# EAGLE schematic OpenROV Controller 2.6 (EAGLE 6.4)

## Sheet 1 of 8
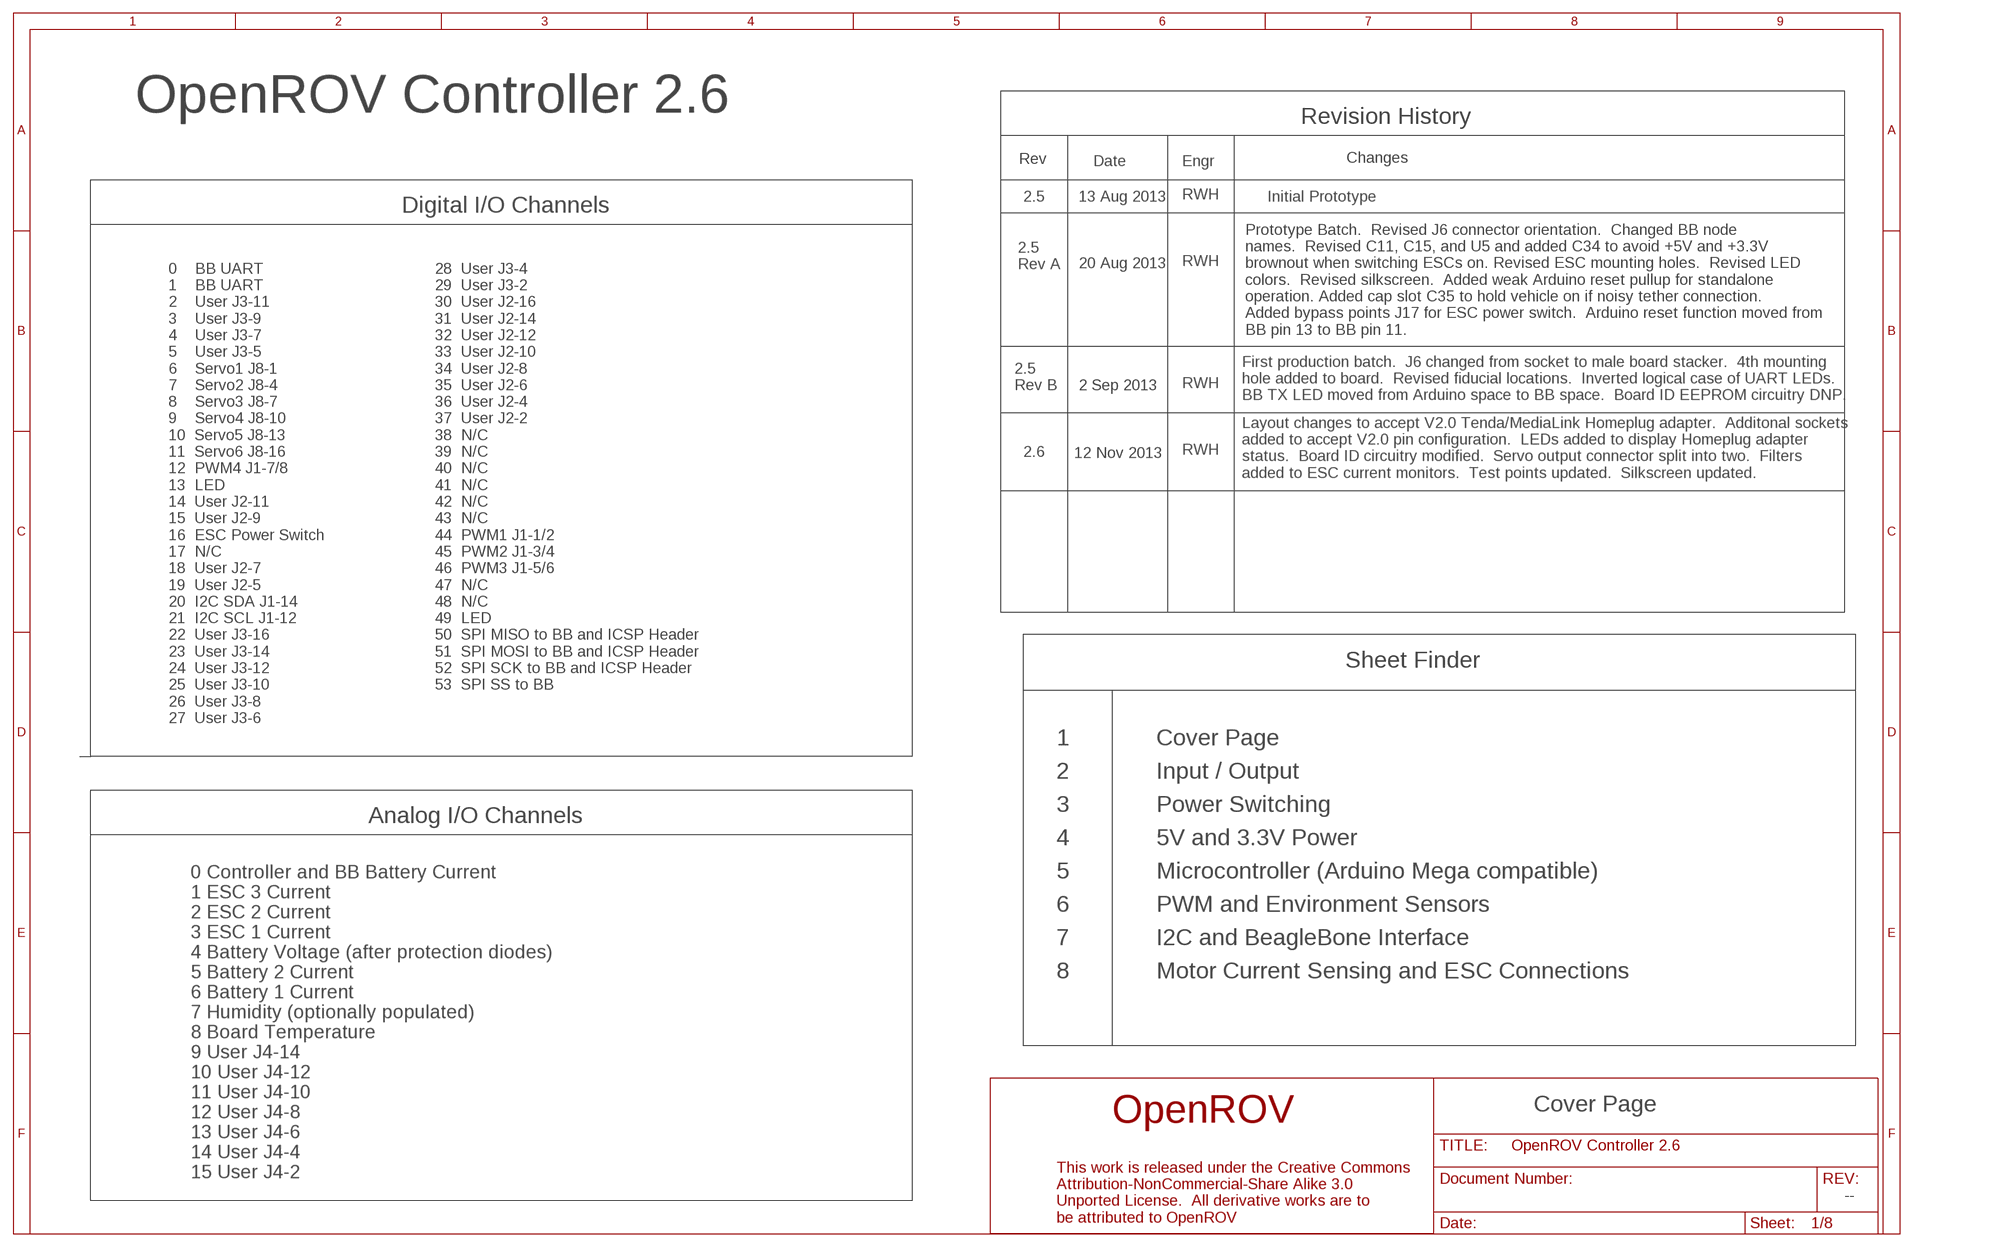
[diagram p0: schematic, sheet 1]

### Notes on the sheet
- OpenROV Controller 2.6
- Revision History
- Rev | Date | Engr | Changes
- 2.5 | 13 Aug 2013 | RWH | Initial Prototype
- Digital I/O Channels
- Prototype Batch.  Revised J6 connector orientation.  Changed BB node
  names.  Revised C11, C15, and U5 and added C34 to avoid +5V and +3.3V
  brownout when switching ESCs on. Revised ESC mounting holes.  Revised LED
  colors.  Revised silkscreen.  Added weak Arduino reset pullup for standalone
  operation. Added cap slot C35 to hold vehicle on if noisy tether connection.
  Added bypass points J17 for ESC power switch.  Arduino reset function moved from
  BB pin 13 to BB pin 11.
- 20 Aug 2013 | RWH
- 2.5
  Rev A
- RWH
- 2.5
  Rev B
- 2 Sep 2013
- First production batch.  J6 changed from socket to male board stacker.  4th mounting
  hole added to board.  Revised fiducial locations.  Inverted logical case of UART LEDs.
  BB TX LED moved from Arduino space to BB space.  Board ID EEPROM circuitry DNP.
- 2.6 | 12 Nov 2013 | RWH
- Layout changes to accept V2.0 Tenda/MediaLink Homeplug adapter.  Additonal sockets
  added to accept V2.0 pin configuration.  LEDs added to display Homeplug adapter
  status.  Board ID circuitry modified.  Servo output connector split into two.  Filters
  added to ESC current monitors.  Test points updated.  Silkscreen updated.
- Sheet Finder
- 0    BB UART
  1    BB UART
  2    User J3-11
  3    User J3-9
  4    User J3-7
  5    User J3-5
  6    Servo1 J8-1
  7    Servo2 J8-4
  8    Servo3 J8-7
  9    Servo4 J8-10
  10  Servo5 J8-13
  11  Servo6 J8-16
  12  PWM4 J1-7/8
  13  LED
  14  User J2-11
  15  User J2-9
  16  ESC Power Switch
  17  N/C
  18  User J2-7
  19  User J2-5
  20  I2C SDA J1-14
  21  I2C SCL J1-12
  22  User J3-16
  23  User J3-14
  24  User J3-12
  25  User J3-10
  26  User J3-8
  27  User J3-6
- 28  User J3-4
  29  User J3-2
  30  User J2-16
  31  User J2-14
  32  User J2-12
  33  User J2-10
  34  User J2-8
  35  User J2-6
  36  User J2-4
  37  User J2-2
  38  N/C
  39  N/C
  40  N/C
  41  N/C
  42  N/C
  43  N/C
  44  PWM1 J1-1/2
  45  PWM2 J1-3/4
  46  PWM3 J1-5/6
  47  N/C
  48  N/C
  49  LED
  50  SPI MISO to BB and ICSP Header
  51  SPI MOSI to BB and ICSP Header
  52  SPI SCK to BB and ICSP Header
  53  SPI SS to BB
- 1 | Cover Page
- 2 | Input / Output
- 3 | Power Switching
- Analog I/O Channels
- 4 | 5V and 3.3V Power
- 5 | Microcontroller (Arduino Mega compatible)
- 6 | PWM and Environment Sensors
- 7 | I2C and BeagleBone Interface
- 8 | Motor Current Sensing and ESC Connections
- Cover Page
- 0	Controller and BB Battery Current
  1	ESC 3 Current
  2	ESC 2 Current
  3	ESC 1 Current
  4	Battery Voltage (after protection diodes)
  5	Battery 2 Current
  6	Battery 1 Current
  7	Humidity (optionally populated)
  8	Board Temperature
  9	User	J4-14
  10	User	J4-12
  11	User	J4-10
  12	User	J4-8
  13	User	J4-6
  14	User	J4-4
  15	User	J4-2
- --

## Sheet 2 of 8
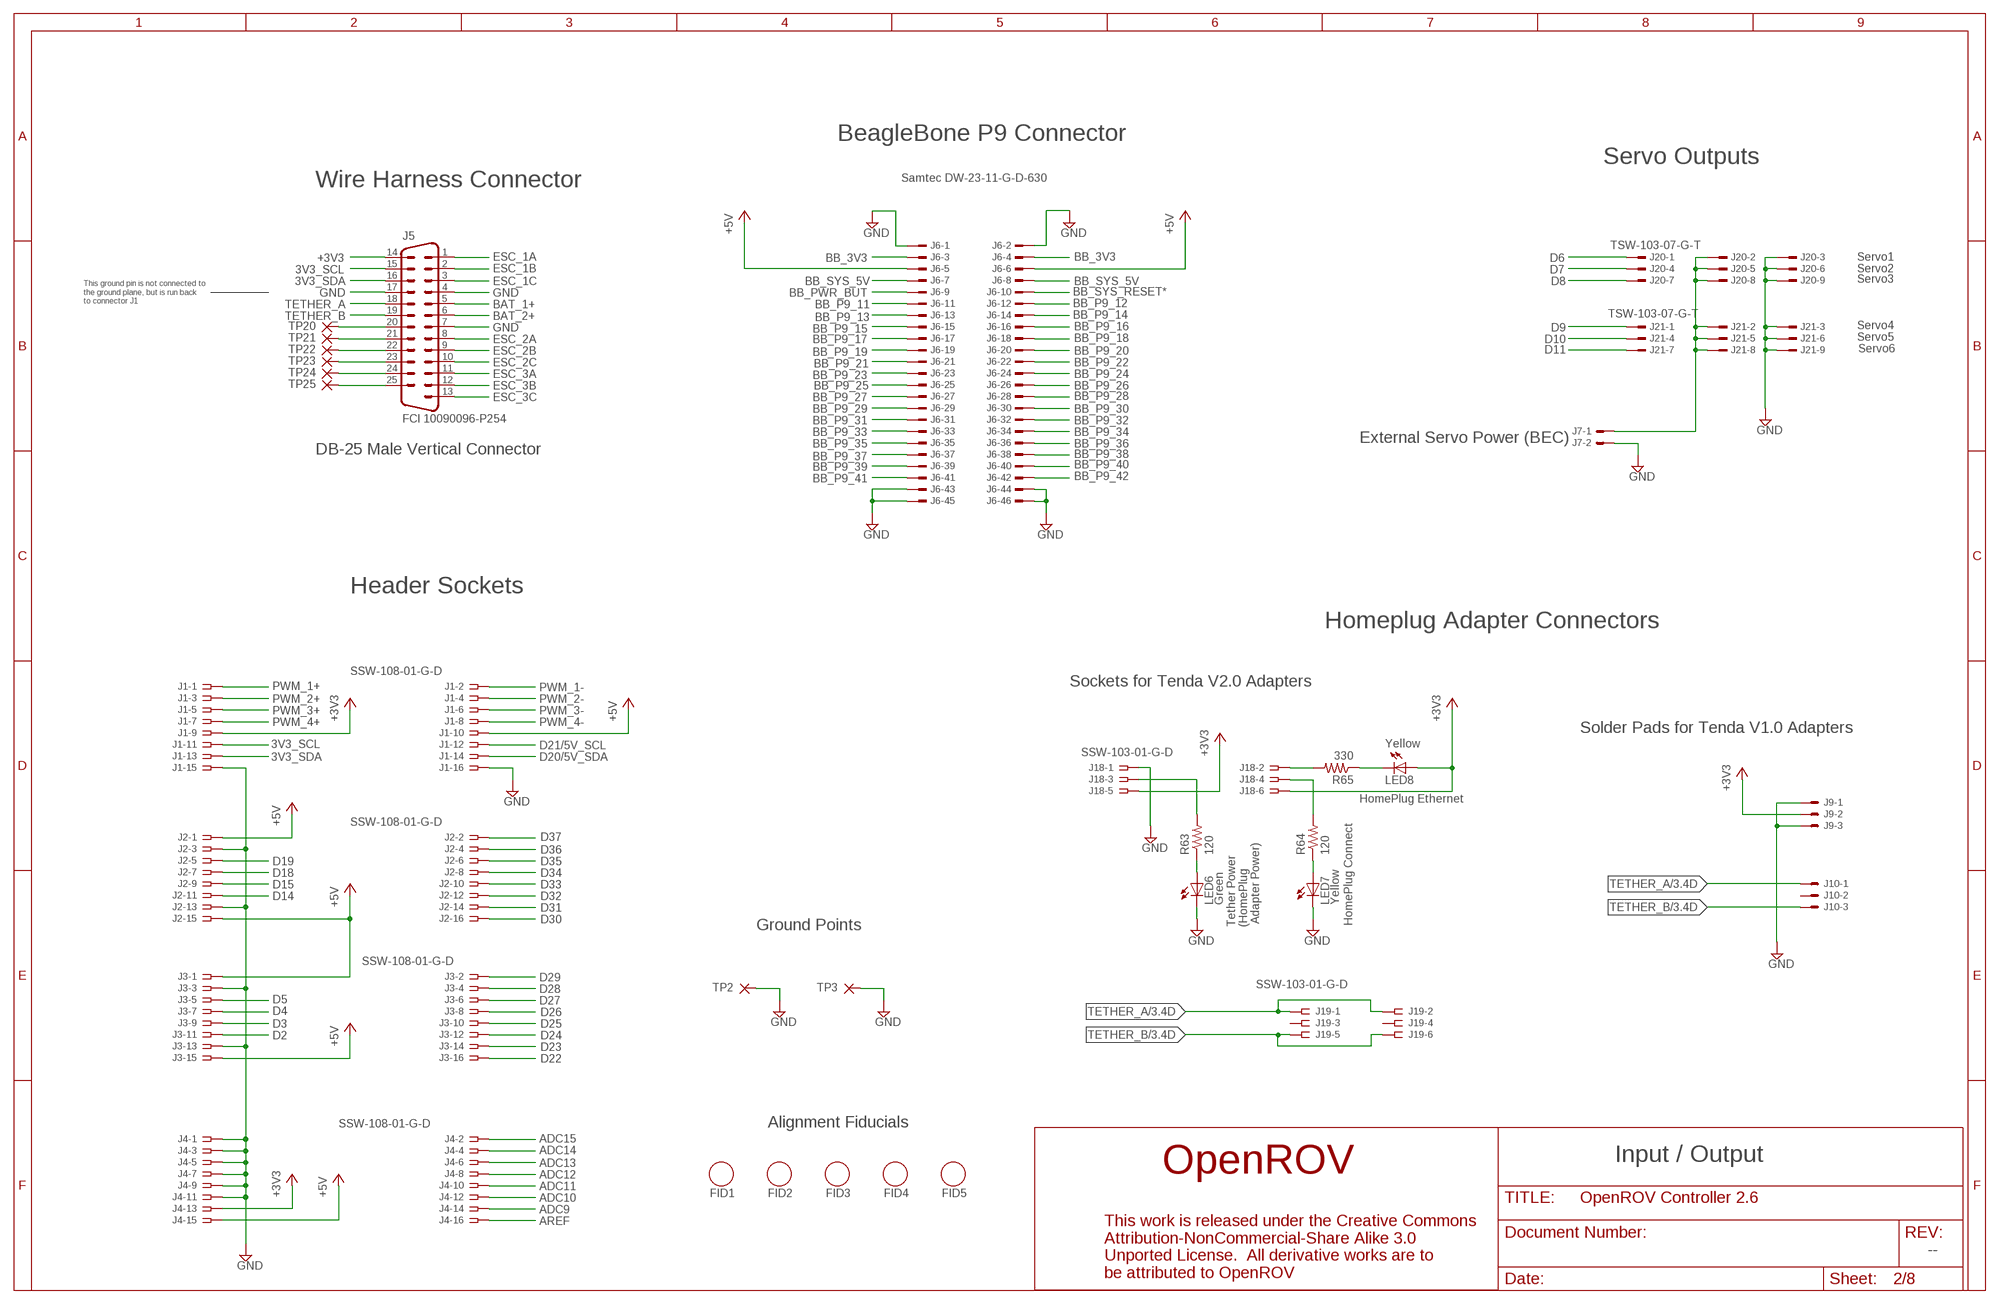
[diagram p1: schematic, sheet 2]

### Parts
FID1  FIDUCIAL_1  [FIDUCIAL_1]
FID2  FIDUCIAL_1  [FIDUCIAL_1]
FID3  FIDUCIAL_1  [FIDUCIAL_1]
FID4  FIDUCIAL_1  [FIDUCIAL_1]
FID5  FIDUCIAL_1  [FIDUCIAL_1]
J1  SSW-108-01-G-D  HDR_SOCKET_2X8  [SSW-108-02-S-D]
J2  SSW-108-01-G-D  HDR_SOCKET_2X8  [SSW-108-02-S-D]
J3  SSW-108-01-G-D  HDR_SOCKET_2X8  [SSW-108-02-S-D]
J4  SSW-108-01-G-D  HDR_SOCKET_2X8  [SSW-108-02-S-D]
J5  FCI 10090096-P254  M25VP  [M25VP]
J6  Samtec DW-23-11-G-D-630  BEAGLEBONE_PIN_HEADER  [TSW-123-02-S-D]
J7  HDR_1X2X0.100-ALT_SILK  [22-23-2021_ALT_SILK]
J9  HDR_1X3X0.100-ALT_SILK  [22-23-2031_ALT_SILK]
J10  HDR_1X3X0.100-ALT_SILK  [22-23-2031_ALT_SILK]
J18  SSW-103-01-G-D  HDR_SOCKET_2X3  [SSW-103-02-S-D]
J19  SSW-103-01-G-D  HDR_SOCKET_2X3  [SSW-103-02-S-D]
J20  TSW-103-07-G-T  HDR_PINS_3X3"  [HDR_PINS_3X3]
J21  TSW-103-07-G-T  HDR_PINS_3X3"  [HDR_PINS_3X3]
LED6  Green  LED-0603  [LED_CHIPLED_0603]
LED7  Yellow  LED-0603  [LED_CHIPLED_0603]
LED8  Yellow  LED-0603  [LED_CHIPLED_0603]
R63  120  RESISTOR-0603  [R0603]
R64  120  RESISTOR-0603  [R0603]
R65  330  RESISTOR-0603  [R0603]
TP2  TEST_PAD-1.0  [2.0/1.0]
TP3  TEST_PAD-1.0  [2.0/1.0]
TP20  TEST_PAD-1.0  [2.0/1.0]
TP21  TEST_PAD-1.0  [2.0/1.0]
TP22  TEST_PAD-1.0  [2.0/1.0]
TP23  TEST_PAD-1.0  [2.0/1.0]
TP24  TEST_PAD-1.0  [2.0/1.0]
TP25  TEST_PAD-1.0  [2.0/1.0]

### Nets
3V3_SCL: J1.11 J5.15 ; also sheet 7
3V3_SDA: J1.13 J5.16 ; also sheet 7
+3V3: J1.9 J4.13 J5.14 J9.2 J18.5 J18.6 LED8.A ; also sheet 4,6,7
+5V: J1.10 J2.1 J2.15 J3.1 J3.15 J4.15 J6.5 J6.6 ; also sheet 3,4,5,6,7,8
ADC9: J4.14 ; also sheet 5
ADC10: J4.12 ; also sheet 5
ADC11: J4.10 ; also sheet 5
ADC12: J4.8 ; also sheet 5
ADC13: J4.6 ; also sheet 5
ADC14: J4.4 ; also sheet 5
ADC15: J4.2 ; also sheet 5
AREF: J4.16 ; also sheet 5
BAT_1+: J5.5 ; also sheet 3
BAT_2+: J5.6 ; also sheet 3
BB_3V3: J6.3 J6.4 ; also sheet 7
BB_P9_11: J6.11 ; also sheet 7
BB_P9_12: J6.12
BB_P9_13: J6.13
BB_P9_14: J6.14
BB_P9_15: J6.15
BB_P9_16: J6.16
BB_P9_17: J6.17 ; also sheet 7
BB_P9_18: J6.18 ; also sheet 7
BB_P9_19: J6.19 ; also sheet 7
BB_P9_20: J6.20 ; also sheet 7
BB_P9_21: J6.21 ; also sheet 7
BB_P9_22: J6.22 ; also sheet 7
BB_P9_23: J6.23
BB_P9_24: J6.24 ; also sheet 7
BB_P9_25: J6.25
BB_P9_26: J6.26 ; also sheet 7
BB_P9_27: J6.27
BB_P9_28: J6.28
BB_P9_29: J6.29
BB_P9_30: J6.30
BB_P9_31: J6.31
BB_P9_32: J6.32
BB_P9_33: J6.33
BB_P9_34: J6.34
BB_P9_35: J6.35
BB_P9_36: J6.36
BB_P9_37: J6.37
BB_P9_38: J6.38
BB_P9_39: J6.39
BB_P9_40: J6.40
BB_P9_41: J6.41
BB_P9_42: J6.42
BB_PWR_BUT: J6.9
BB_SYS_5V: J6.7 J6.8
BB_SYS_RESET*: J6.10 ; also sheet 7
D2: J3.11 ; also sheet 5
D3: J3.9 ; also sheet 5
D4: J3.7 ; also sheet 5
D5: J3.5 ; also sheet 5
D6: J20.P1 ; also sheet 5
D7: J20.P4 ; also sheet 5
D8: J20.P7 ; also sheet 5
D9: J21.P1 ; also sheet 5
D10: J21.P4 ; also sheet 5
D11: J21.P7 ; also sheet 5
D14: J2.11 ; also sheet 5
D15: J2.9 ; also sheet 5
D18: J2.7 ; also sheet 5
D19: J2.5 ; also sheet 5
D20/5V_SDA: J1.14 ; also sheet 5,7
D21/5V_SCL: J1.12 ; also sheet 5,7
D22: J3.16 ; also sheet 5
D23: J3.14 ; also sheet 5
D24: J3.12 ; also sheet 5
D25: J3.10 ; also sheet 5
D26: J3.8 ; also sheet 5
D27: J3.6 ; also sheet 5
D28: J3.4 ; also sheet 5
D29: J3.2 ; also sheet 5
D30: J2.16 ; also sheet 5
D31: J2.14 ; also sheet 5
D32: J2.12 ; also sheet 5
D33: J2.10 ; also sheet 5
D34: J2.8 ; also sheet 5
D35: J2.6 ; also sheet 5
D36: J2.4 ; also sheet 5
D37: J2.2 ; also sheet 5
ESC_1A: J5.1 ; also sheet 8
ESC_1B: J5.2 ; also sheet 8
ESC_1C: J5.3 ; also sheet 8
ESC_2A: J5.8 ; also sheet 8
ESC_2B: J5.9 ; also sheet 8
ESC_2C: J5.10 ; also sheet 8
ESC_3A: J5.11 ; also sheet 8
ESC_3B: J5.12 ; also sheet 8
ESC_3C: J5.13 ; also sheet 8
GND: J1.15 J1.16 J2.3 J2.13 J3.3 J3.13 J4.1 J4.3 J4.5 J4.7 J4.9 J4.11 J5.4 J5.7 J5.17 J6.1 J6.2 J6.43 J6.44 J6.45 J6.46 J7.2 J9.1 J9.3 J18.1 J20.P3 J20.P6 J20.P9 J21.P3 J21.P6 J21.P9 LED6.C LED7.C TP2.1(P) TP3.1(P) ; also sheet 3,4,5,6,7,8
N$9: LED6.A R63.1
N$21: J5.24 TP24.1(P)
N$22: J5.20 TP20.1(P)
N$26: J7.1 J20.P2 J20.P5 J20.P8 J21.P2 J21.P5 J21.P8
N$29: J5.21 TP21.1(P)
N$30: J5.22 TP22.1(P)
N$31: J5.23 TP23.1(P)
N$32: J5.25 TP25.1(P)
N$46: J18.3 R63.2
N$48: J18.4 R64.2
N$49: LED7.A R64.1
N$50: J18.2 R65.2
N$51: LED8.C R65.1
PWM_1+: J1.1 ; also sheet 6
PWM_1-: J1.2 ; also sheet 6
PWM_2+: J1.3 ; also sheet 6
PWM_2-: J1.4 ; also sheet 6
PWM_3+: J1.5 ; also sheet 6
PWM_3-: J1.6 ; also sheet 6
PWM_4+: J1.7 ; also sheet 6
PWM_4-: J1.8 ; also sheet 6
TETHER_A: J5.18 J10.1 J19.1 J19.2 ; also sheet 3
TETHER_B: J5.19 J10.3 J19.5 J19.6 ; also sheet 3
Unconnected: J5.G1 J5.G2 J10.2 J19.3 J19.4

### Notes on the sheet
- BeagleBone P9 Connector
- Servo Outputs
- Wire Harness Connector
- Servo1
- Servo2
- Servo3
- This ground pin is not connected to
  the ground plane, but is run back
  to connector J1
- Servo4
- Servo5
- Servo6
- External Servo Power (BEC)
- DB-25 Male Vertical Connector
- Header Sockets
- Homeplug Adapter Connectors
- Sockets for Tenda V2.0 Adapters
- Solder Pads for Tenda V1.0 Adapters
- HomePlug Ethernet
- HomePlug Connect
- Tether Power
  (HomePlug
   Adapter Power)
- Ground Points
- Alignment Fiducials
- Input / Output
- --

## Sheet 3 of 8
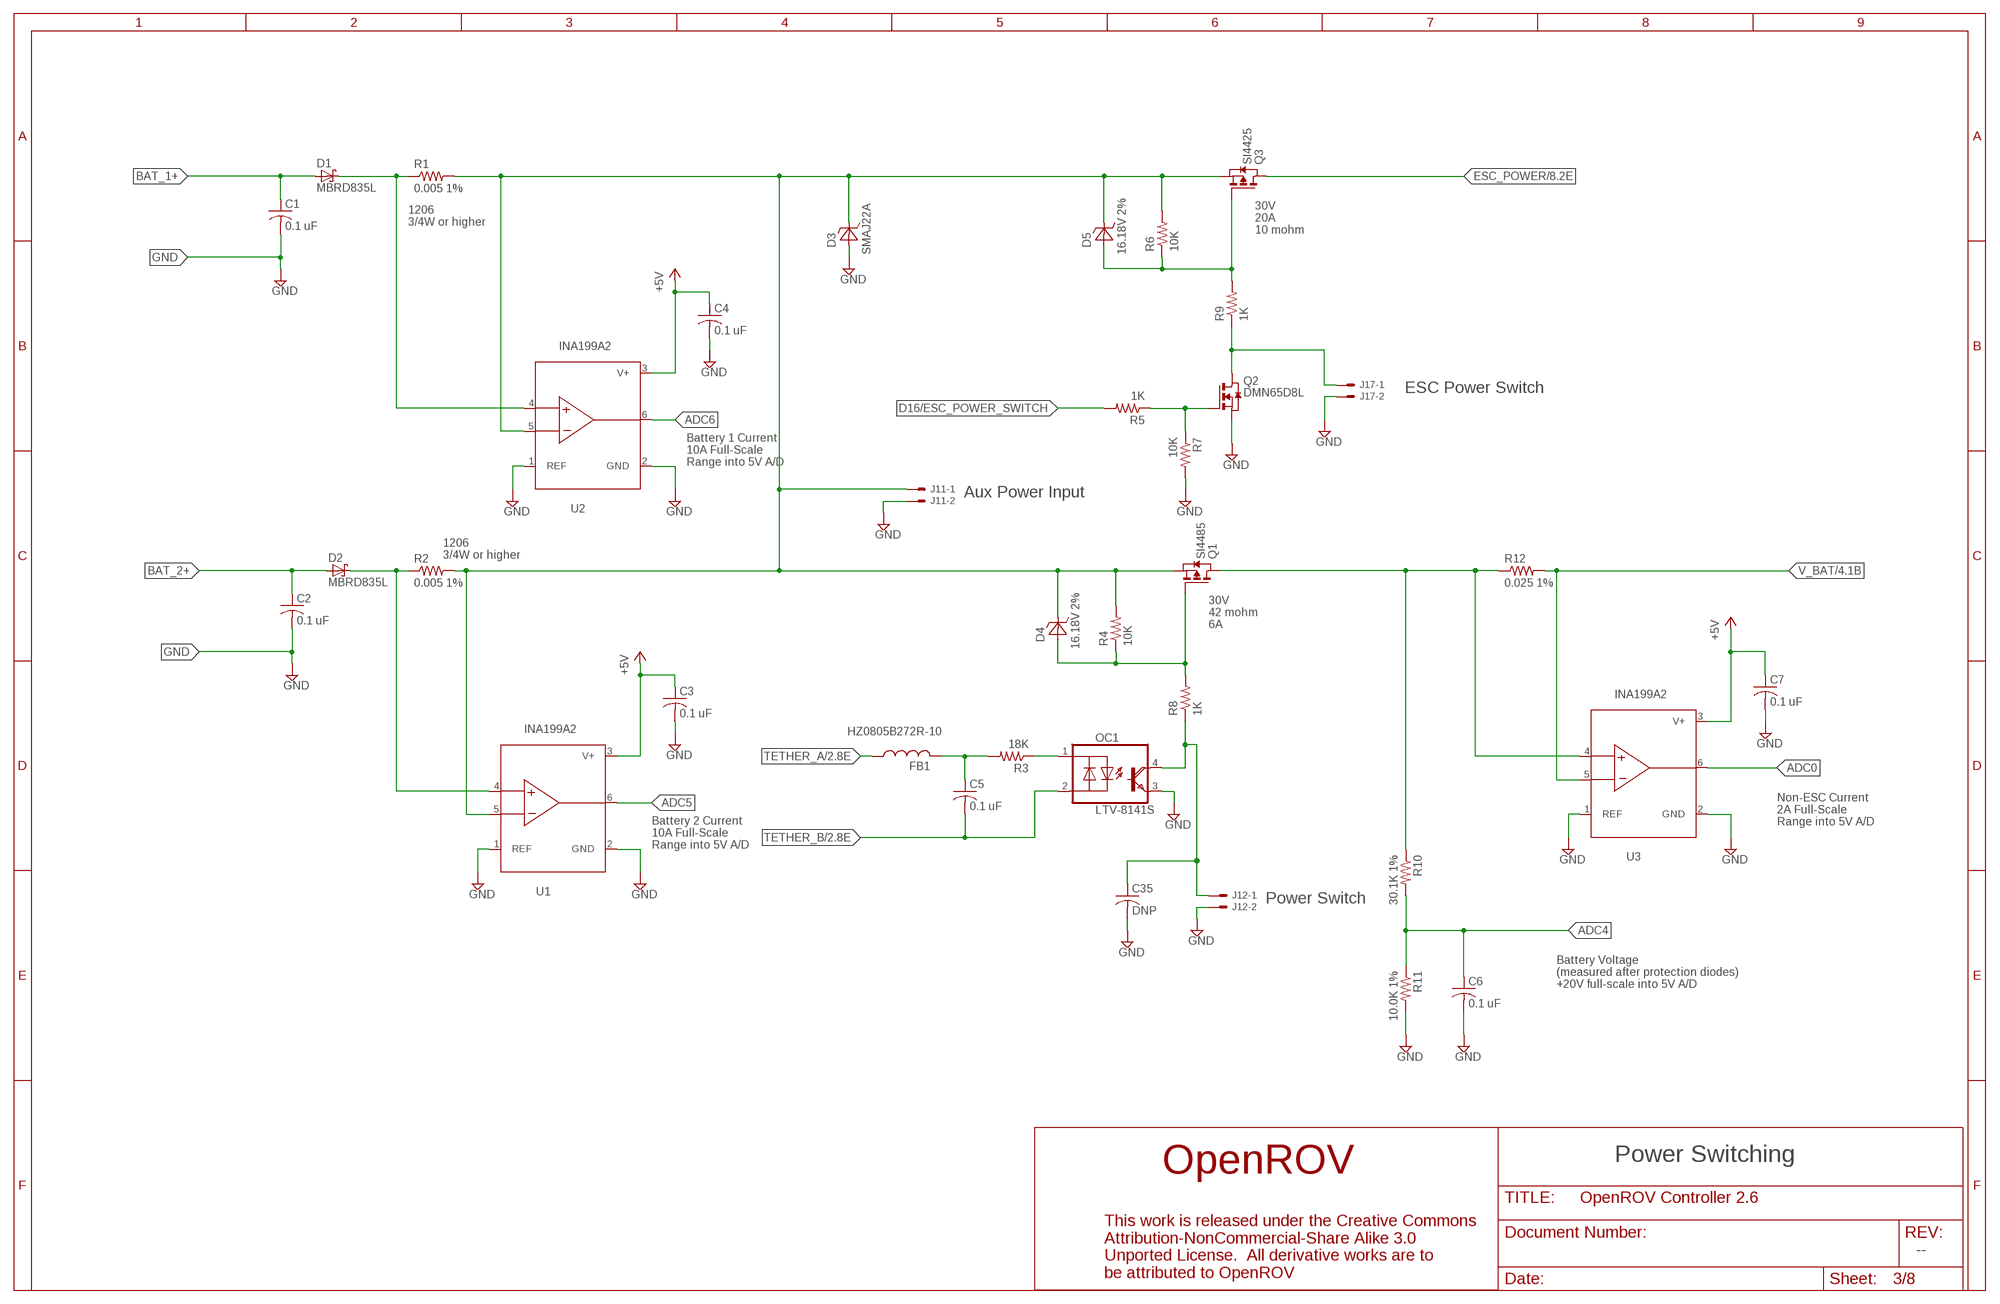
[diagram p2: schematic, sheet 3]

### Parts
C1  0.1 uF  CAP0603  [R0603]
C2  0.1 uF  CAP0603  [R0603]
C3  0.1 uF  CAP0603  [R0603]
C4  0.1 uF  CAP0603  [R0603]
C5  0.1 uF  CAP0603  [R0603]
C6  0.1 uF  CAP0603  [R0603]
C7  0.1 uF  CAP0603  [R0603]
C35  DNP  CAP0805  [R0805]
D1  MBRD835L  SCHOTTKYDPAK  [DPAK]
D2  MBRD835L  SCHOTTKYDPAK  [DPAK]
D3  SMAJ22A  ZENER-TVSDO-214AC  [DO214AC]
D4  16.18V 2%  ZENER-TVSSOD323  [SOD323]
D5  16.18V 2%  ZENER-TVSSOD323  [SOD323]
FB1  HZ0805B272R-10  FERRITESIZE_0805  [R0805]
J11  HDR_1X2X0.100-ALT_SILK  [22-23-2021_ALT_SILK]
J12  HDR_1X2X0.100-ALT_SILK  [22-23-2021_ALT_SILK]
J17  HDR_1X2X0.100-ALT_SILK  [22-23-2021_ALT_SILK]
OC1  LTV-8141S  [DIL4-SMD]
Q1  SI4485  PMOS-FET  [SO8]
Q2  DMN65D8L  NMOS-FETSOT23  [SOT23]
Q3  SI4425  PMOS-FET  [SO8]
R1  0.005 1%  RESISTOR-1206  [R1206]
R2  0.005 1%  RESISTOR-1206  [R1206]
R3  18K  RESISTOR-0603  [R0603]
R4  10K  RESISTOR-0603  [R0603]
R5  1K  RESISTOR-0603  [R0603]
R6  10K  RESISTOR-0603  [R0603]
R7  10K  RESISTOR-0603  [R0603]
R8  1K  RESISTOR-0603  [R0603]
R9  1K  RESISTOR-0603  [R0603]
R10  30.1K 1%  RESISTOR-0603  [R0603]
R11  10.0K 1%  RESISTOR-0603  [R0603]
R12  0.025 1%  RESISTOR-0805  [R0805]
U1  INA199A2  INA199  [SC70-6L]
U2  INA199A2  INA199  [SC70-6L]
U3  INA199A2  INA199  [SC70-6L]

### Nets
+5V: C3.1 C4.1 C7.1 U1.3(V+) U2.3(V+) U3.3(V+) ; also sheet 2,4,5,6,7,8
ADC0: U3.6(VOUT) ; also sheet 5
ADC4: C6.1 R10.2 R11.1 ; also sheet 5
ADC5: U1.6(VOUT) ; also sheet 5
ADC6: U2.6(VOUT) ; also sheet 5
BAT_1+: C1.1 D1.1(A) D1.3(A) ; also sheet 2
BAT_1-1: Q1.5(D) Q1.6(D) Q1.7(D) Q1.8(D) R10.1 R12.1 U3.4(IN+)
BAT_2+: C2.1 D2.1(A) D2.3(A) ; also sheet 2
D16/ESC_POWER_SWITCH: R5.2 ; also sheet 5
ESC_POWER: Q3.5(D) Q3.6(D) Q3.7(D) Q3.8(D) ; also sheet 8
GND: C1.2 C2.2 C3.2 C4.2 C6.2 C7.2 C35.2 D3.A J11.2 J12.2 J17.2 OC1.3(E) Q2.2(S) R7.2 R11.2 U1.1(REF) U1.2(GND) U2.1(REF) U2.2(GND) U3.1(REF) U3.2(GND) ; also sheet 2,4,5,6,7,8
N$1: OC1.1(IN-A) R3.1
N$2: D5.A Q3.4(G) R6.1 R9.2
N$3: J17.1 Q2.3(D) R9.1
N$4: D1.4(C) R1.1 U2.4(IN+)
N$6: Q2.1(G) R5.1 R7.1
N$7: D3.C D4.C D5.C J11.1 Q1.1(S) Q1.2(S) Q1.3(S) Q3.1(S) Q3.2(S) Q3.3(S) R1.2 R2.2 R4.2 R6.2 U1.5(IN-) U2.5(IN-)
N$8: D4.A Q1.4(G) R4.1 R8.2
N$10: C5.1 FB1.2 R3.2
N$41: D2.4(C) R2.1 U1.4(IN+)
N$45: C35.1 J12.1 OC1.4(C) R8.1
TETHER_A: FB1.1 ; also sheet 2
TETHER_B: C5.2 OC1.2(IN-B) ; also sheet 2
V_BAT: R12.2 U3.5(IN-) ; also sheet 4,6

### Notes on the sheet
- 1206
  3/4W or higher
- 30V
  20A
  10 mohm
- ESC Power Switch
- Battery 1 Current
  10A Full-Scale
  Range into 5V A/D
- Aux Power Input
- 1206
  3/4W or higher
- 30V
  42 mohm
  6A
- Non-ESC Current
  2A Full-Scale
  Range into 5V A/D
- Battery 2 Current
  10A Full-Scale
  Range into 5V A/D
- Power Switch
- Battery Voltage
  (measured after protection diodes)
  +20V full-scale into 5V A/D
- Power Switching
- --

## Sheet 4 of 8
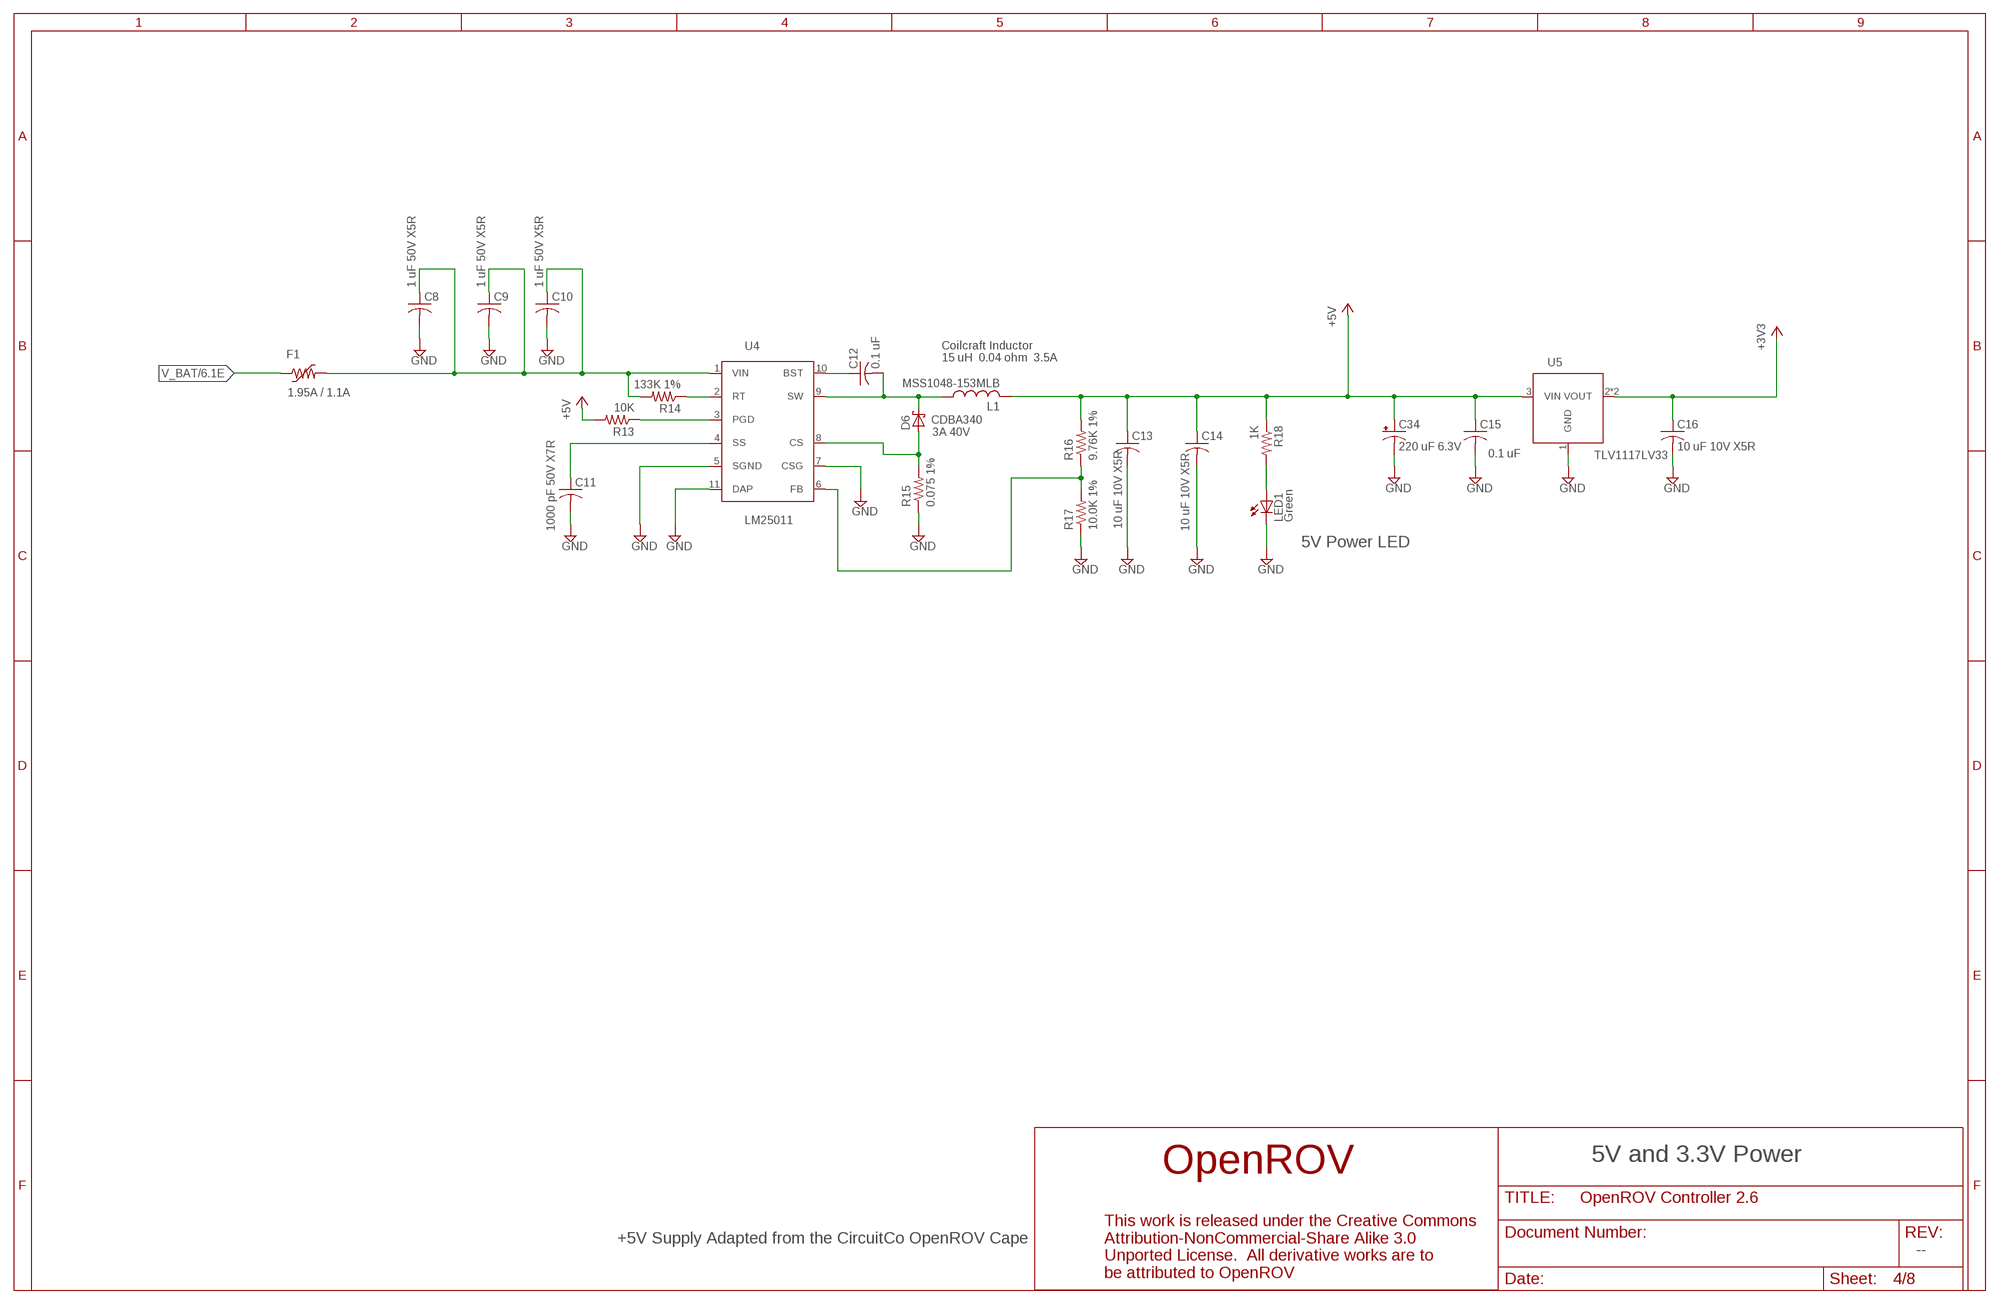
[diagram p3: schematic, sheet 4]

### Parts
C8  1 uF 50V X5R  CAP0805  [R0805]
C9  1 uF 50V X5R  CAP0805  [R0805]
C10  1 uF 50V X5R  CAP0805  [R0805]
C11  1000 pF 50V X7R  CAP0603  [R0603]
C12  0.1 uF  CAP0603  [R0603]
C13  10 uF 10V X5R  CAP0805  [R0805]
C14  10 uF 10V X5R  CAP0805  [R0805]
C15  0.1 uF  CAP0603  [R0603]
C16  10 uF 10V X5R  CAP0805  [R0805]
C34  220 uF 6.3V  CAP-POLARIZED-B_CASE  [KEMET_B-CAPACITOR]
D6  CDBA340  SCHOTTKYDO214AC  [DO214AC]
F1  1.95A / 1.1A  POLYFUSE-1812  [R1812]
L1  MSS1048-153MLB  INDUCTOR-MSS1048  [MSS1048]
LED1  Green  LED-0603  [LED_CHIPLED_0603]
R13  10K  RESISTOR-0603  [R0603]
R14  133K 1%  RESISTOR-0603  [R0603]
R15  0.075 1%  RESISTOR-1210  [R1210]
R16  9.76K 1%  RESISTOR-0603  [R0603]
R17  10.0K 1%  RESISTOR-0603  [R0603]
R18  1K  RESISTOR-0603  [R0603]
U4  LM25011  [VSSOP-10]
U5  TLV1117LV33  AP1117SOT223  [SOT223]

### Nets
+3V3: C16.1 U5.2(VOUT) U5.4(VOUT) ; also sheet 2,6,7
+5V: C13.1 C14.1 C15.1 C34.+ L1.P$2 R13.2 R16.2 R18.1 U5.3(VIN) ; also sheet 2,3,5,6,7,8
FUSED_VBAT: C8.1 C9.1 C10.1 F1.2 R14.2 U4.1(VIN)
GND: C8.2 C9.2 C10.2 C11.2 C13.2 C14.2 C15.2 C16.2 C34.- LED1.C R15.1 R17.1 U4.5(SGND) U4.7(CSG) U4.11(DAP) U5.1(GND) ; also sheet 2,3,5,6,7,8
N$11: LED1.A R18.2
N$16: R16.1 R17.2 U4.6(FB)
N$20: D6.A R15.2 U4.8(CS)
N$23: C11.1 U4.4(SS)
N$24: C12.1 U4.10(BST)
N$25: C12.2 D6.C L1.P$1 U4.9(SW)
N$27: R14.1 U4.2(RT)
N$28: R13.1 U4.3(PGD)
V_BAT: F1.1 ; also sheet 3,6

### Notes on the sheet
- Coilcraft Inductor
  15 uH  0.04 ohm  3.5A
- 3A 40V
- 5V Power LED
- 5V and 3.3V Power
- +5V Supply Adapted from the CircuitCo OpenROV Cape
- --

## Sheet 5 of 8
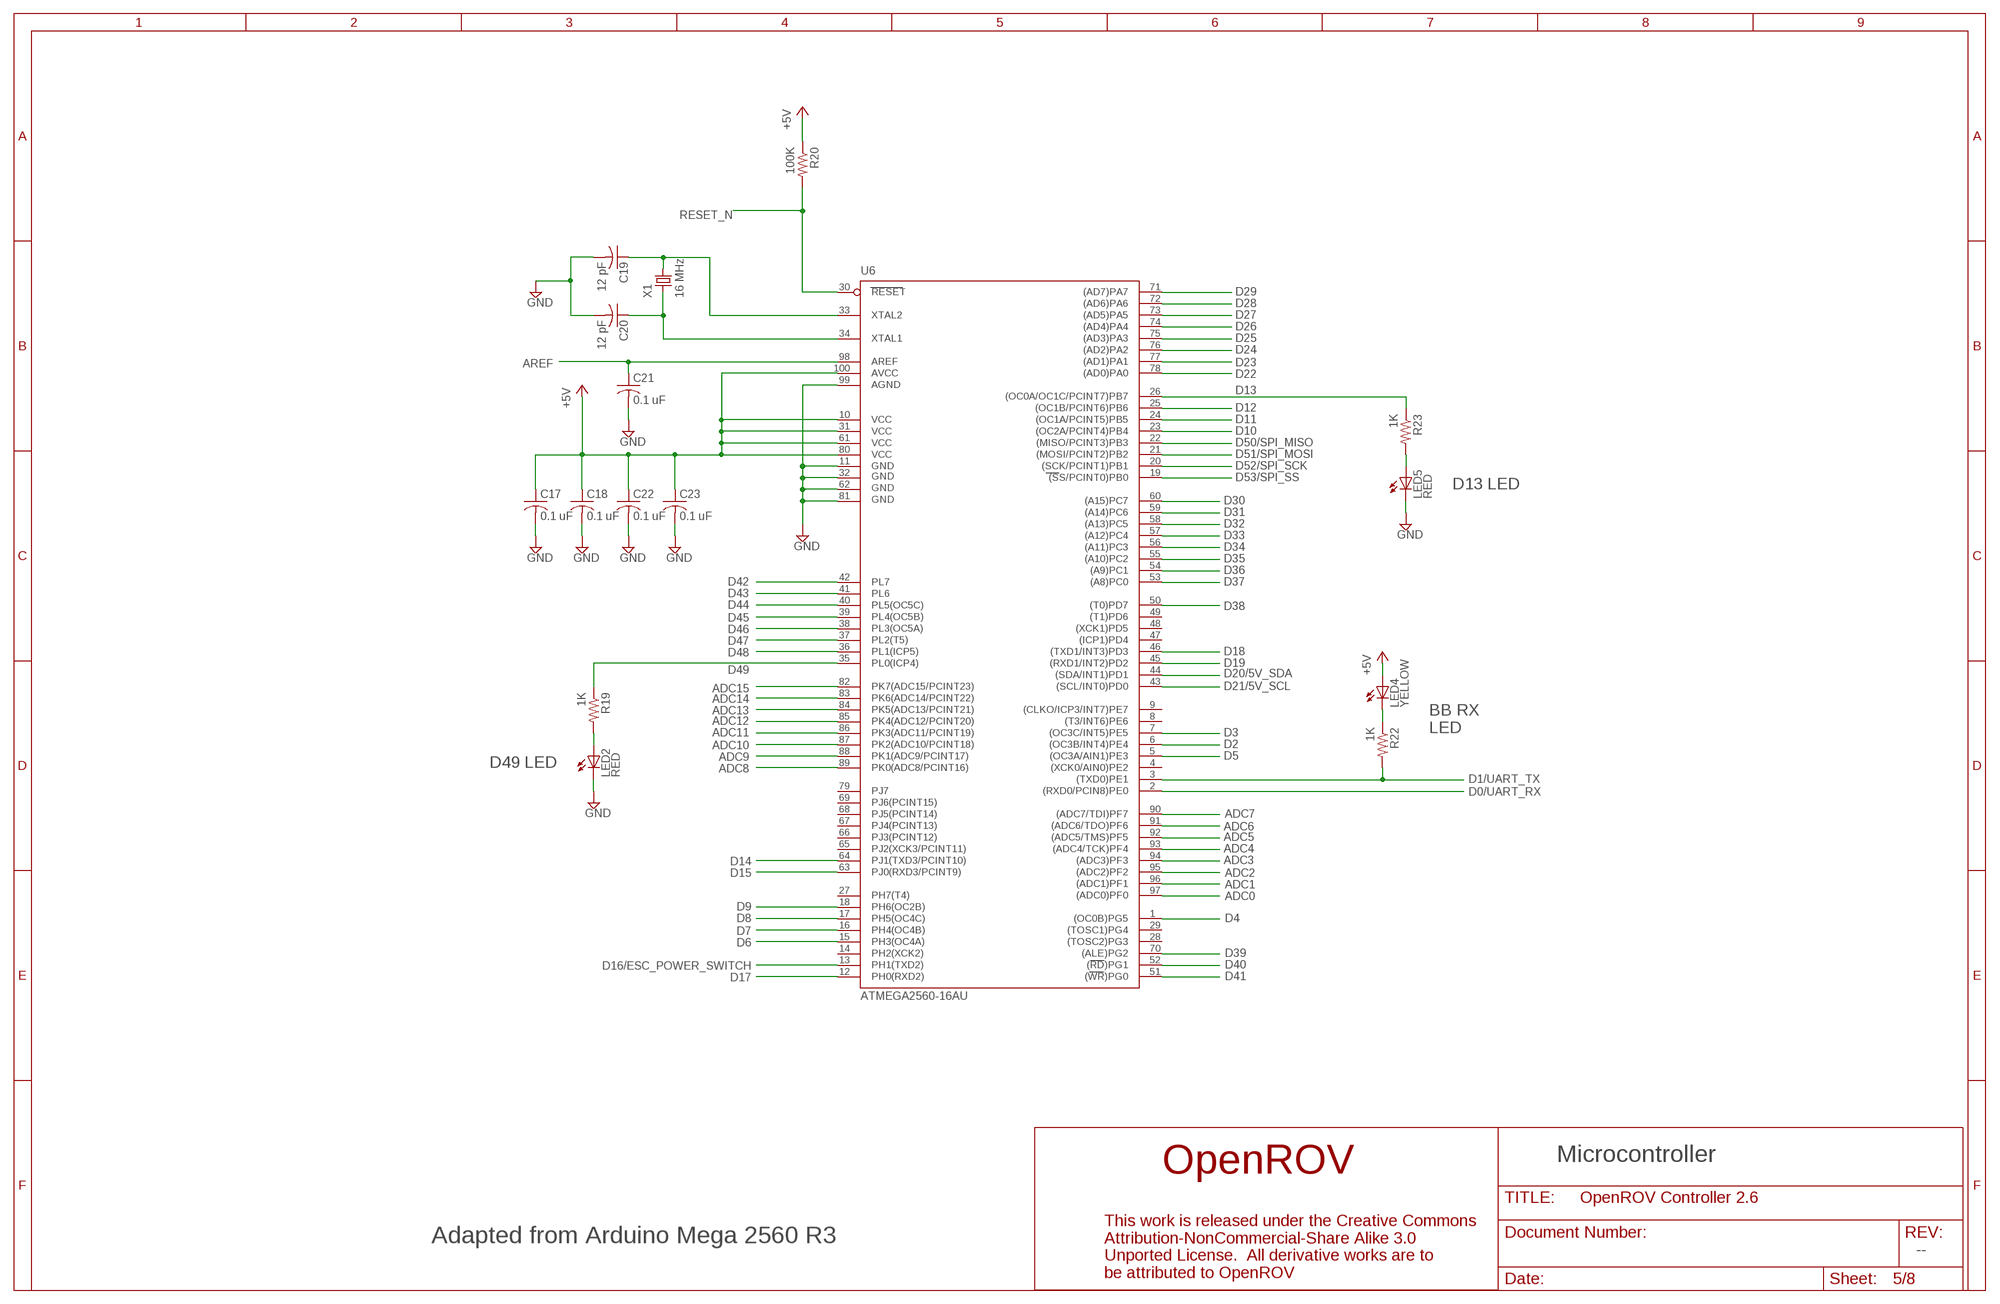
[diagram p4: schematic, sheet 5]

### Parts
C17  0.1 uF  CAP0603  [R0603]
C18  0.1 uF  CAP0603  [R0603]
C19  12 pF  CAP0603  [R0603]
C20  12 pF  CAP0603  [R0603]
C21  0.1 uF  CAP0603  [R0603]
C22  0.1 uF  CAP0603  [R0603]
C23  0.1 uF  CAP0603  [R0603]
LED2  RED  LED-0603  [LED_CHIPLED_0603]
LED4  YELLOW  LED-0603  [LED_CHIPLED_0603]
LED5  RED  LED-0603  [LED_CHIPLED_0603]
R19  1K  RESISTOR-0603  [R0603]
R20  100K  RESISTOR-0603  [R0603]
R22  1K  RESISTOR-0603  [R0603]
R23  1K  RESISTOR-0603  [R0603]
U6  ATMEGA2560-16AU  SMARTPRJ_ATMEGA25602560-16AU  [SMARTPRJ_TQFP100]
X1  16 MHz  CRYSTAL-5*3.2  [DISCRETE_2P-SMD-5X3.2]

### Nets
+5V: C17.1 C18.1 C22.1 C23.1 LED4.A R20.1 U6.10(VCC) U6.31(VCC1) U6.61(VCC2) U6.80(VCC3) U6.100(AVCC) ; also sheet 2,3,4,6,7,8
ADC0: U6.97((ADC0)PF0) ; also sheet 3
ADC1: U6.96((ADC1)PF1) ; also sheet 8
ADC2: U6.95((ADC2)PF2) ; also sheet 8
ADC3: U6.94((ADC3)PF3) ; also sheet 8
ADC4: U6.93((ADC4/TCK)PF4) ; also sheet 3
ADC5: U6.92((ADC5/TMS)PF5) ; also sheet 3
ADC6: U6.91((ADC6/TDO)PF6) ; also sheet 3
ADC7: U6.90((ADC7/TDI)PF7) ; also sheet 6
ADC8: U6.89(PK0(ADC8/PCINT16)) ; also sheet 6
ADC9: U6.88(PK1(ADC9/PCINT17)) ; also sheet 2
ADC10: U6.87(PK2(ADC10/PCINT18)) ; also sheet 2
ADC11: U6.86(PK3(ADC11/PCINT19)) ; also sheet 2
ADC12: U6.85(PK4(ADC12/PCINT20)) ; also sheet 2
ADC13: U6.84(PK5(ADC13/PCINT21)) ; also sheet 2
ADC14: U6.83(PK6(ADC14/PCINT22)) ; also sheet 2
ADC15: U6.82(PK7(ADC15/PCINT23)) ; also sheet 2
AREF: C21.1 U6.98(AREF) ; also sheet 2
D0/UART_RX: U6.2((RXD0/PCIN8)PE0) ; also sheet 7
D1/UART_TX: R22.2 U6.3((TXD0)PE1) ; also sheet 7
D2: U6.6((OC3B/INT4)PE4) ; also sheet 2
D3: U6.7((OC3C/INT5)PE5) ; also sheet 2
D4: U6.1((OC0B)PG5) ; also sheet 2
D5: U6.5((OC3A/AIN1)PE3) ; also sheet 2
D6: U6.15(PH3(OC4A)) ; also sheet 2
D7: U6.16(PH4(OC4B)) ; also sheet 2
D8: U6.17(PH5(OC4C)) ; also sheet 2
D9: U6.18(PH6(OC2B)) ; also sheet 2
D10: U6.23((OC2A/PCINT4)PB4) ; also sheet 2
D11: U6.24((OC1A/PCINT5)PB5) ; also sheet 2
D12: U6.25((OC1B/PCINT6)PB6) ; also sheet 6
D13: R23.1 U6.26((OC0A/OC1C/PCINT7)PB7)
D14: U6.64(PJ1(TXD3/PCINT10)) ; also sheet 2
D15: U6.63(PJ0(RXD3/PCINT9)) ; also sheet 2
D16/ESC_POWER_SWITCH: U6.13(PH1(TXD2)) ; also sheet 3
D17: U6.12(PH0(RXD2))
D18: U6.46((TXD1/INT3)PD3) ; also sheet 2
D19: U6.45((RXD1/INT2)PD2) ; also sheet 2
D20/5V_SDA: U6.44((SDA/INT1)PD1) ; also sheet 2,7
D21/5V_SCL: U6.43((SCL/INT0)PD0) ; also sheet 2,7
D22: U6.78((AD0)PA0) ; also sheet 2
D23: U6.77((AD1)PA1) ; also sheet 2
D24: U6.76((AD2)PA2) ; also sheet 2
D25: U6.75((AD3)PA3) ; also sheet 2
D26: U6.74((AD4)PA4) ; also sheet 2
D27: U6.73((AD5)PA5) ; also sheet 2
D28: U6.72((AD6)PA6) ; also sheet 2
D29: U6.71((AD7)PA7) ; also sheet 2
D30: U6.60((A15)PC7) ; also sheet 2
D31: U6.59((A14)PC6) ; also sheet 2
D32: U6.58((A13)PC5) ; also sheet 2
D33: U6.57((A12)PC4) ; also sheet 2
D34: U6.56((A11)PC3) ; also sheet 2
D35: U6.55((A10)PC2) ; also sheet 2
D36: U6.54((A9)PC1) ; also sheet 2
D37: U6.53((A8)PC0) ; also sheet 2
D38: U6.50((T0)PD7)
D39: U6.70((ALE)PG2)
D40: U6.52((RD)PG1)
D41: U6.51((WR)PG0)
D42: U6.42(PL7)
D43: U6.41(PL6)
D44: U6.40(PL5(OC5C)) ; also sheet 6
D45: U6.39(PL4(OC5B)) ; also sheet 6
D46: U6.38(PL3(OC5A)) ; also sheet 6
D47: U6.37(PL2(T5))
D48: U6.36(PL1(ICP5))
D49: R19.1 U6.35(PL0(ICP4))
D50/SPI_MISO: U6.22((MISO/PCINT3)PB3) ; also sheet 7
D51/SPI_MOSI: U6.21((MOSI/PCINT2)PB2) ; also sheet 7
D52/SPI_SCK: U6.20((SCK/PCINT1)PB1) ; also sheet 7
D53/SPI_SS: U6.19((SS/PCINT0)PB0) ; also sheet 7
GND: C17.2 C18.2 C19.2 C20.2 C21.2 C22.2 C23.2 LED2.C LED5.C U6.11(GND) U6.32(GND1) U6.62(GND2) U6.81(GND3) U6.99(AGND) ; also sheet 2,3,4,6,7,8
N$5: LED2.A R19.2
N$15: C19.1 U6.33(XTAL2) X1.2
N$35: C20.1 U6.34(XTAL1) X1.1
N$36: LED5.A R23.2
N$42: LED4.C R22.1
RESET_N: R20.2 U6.30(RESET) ; also sheet 7
Unconnected: U6.4((XCK0/AIN0)PE2) U6.8((T3/INT6)PE6) U6.9((CLKO/ICP3/INT7)PE7) U6.14(PH2(XCK2)) U6.27(PH7(T4)) U6.28((TOSC2)PG3) U6.29((TOSC1)PG4) U6.47((ICP1)PD4) U6.48((XCK1)PD5) U6.49((T1)PD6) U6.65(PJ2(XCK3/PCINT11)) U6.66(PJ3(PCINT12)) U6.67(PJ4(PCINT13)) U6.68(PJ5(PCINT14)) U6.69(PJ6(PCINT15)) U6.79(PJ7)

### Notes on the sheet
- D13 LED
- BB RX
  LED
- D49 LED
- Microcontroller
- Adapted from Arduino Mega 2560 R3
- --

## Sheet 6 of 8
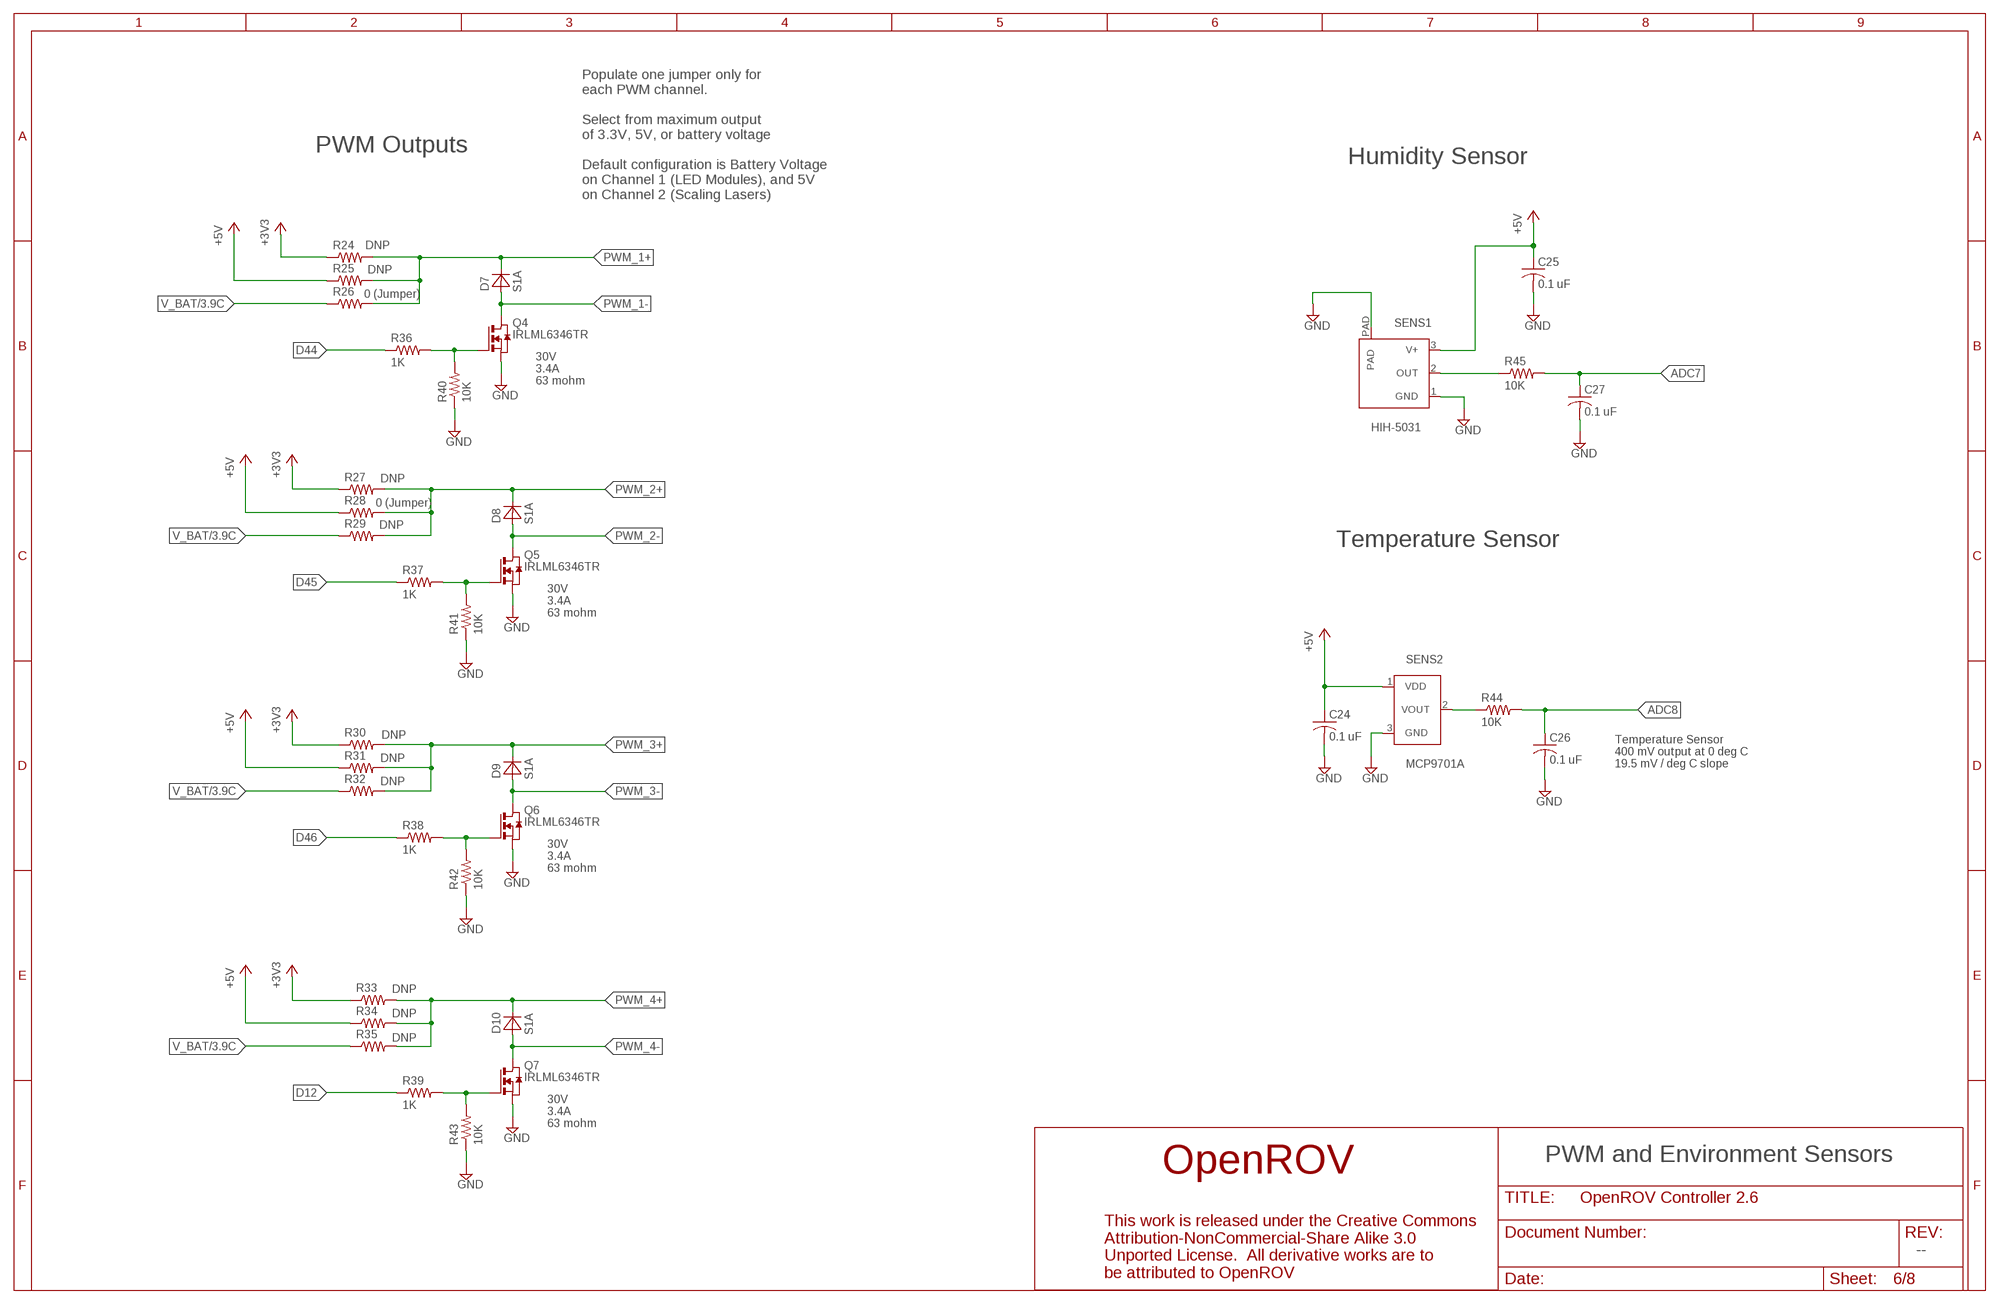
[diagram p5: schematic, sheet 6]

### Parts
C24  0.1 uF  CAP0603  [R0603]
C25  0.1 uF  CAP0603  [R0603]
C26  0.1 uF  CAP0603  [R0603]
C27  0.1 uF  CAP0603  [R0603]
D7  S1A  DIODE  [DO214AC]
D8  S1A  DIODE  [DO214AC]
D9  S1A  DIODE  [DO214AC]
D10  S1A  DIODE  [DO214AC]
Q4  IRLML6346TR  NMOS-FETSOT23  [SOT23]
Q5  IRLML6346TR  NMOS-FETSOT23  [SOT23]
Q6  IRLML6346TR  NMOS-FETSOT23  [SOT23]
Q7  IRLML6346TR  NMOS-FETSOT23  [SOT23]
R24  DNP  RESISTOR-0603  [R0603]
R25  DNP  RESISTOR-0603  [R0603]
R26  0 (Jumper)  RESISTOR-0603  [R0603]
R27  DNP  RESISTOR-0603  [R0603]
R28  0 (Jumper)  RESISTOR-0603  [R0603]
R29  DNP  RESISTOR-0603  [R0603]
R30  DNP  RESISTOR-0603  [R0603]
R31  DNP  RESISTOR-0603  [R0603]
R32  DNP  RESISTOR-0603  [R0603]
R33  DNP  RESISTOR-0603  [R0603]
R34  DNP  RESISTOR-0603  [R0603]
R35  DNP  RESISTOR-0603  [R0603]
R36  1K  RESISTOR-0603  [R0603]
R37  1K  RESISTOR-0603  [R0603]
R38  1K  RESISTOR-0603  [R0603]
R39  1K  RESISTOR-0603  [R0603]
R40  10K  RESISTOR-0603  [R0603]
R41  10K  RESISTOR-0603  [R0603]
R42  10K  RESISTOR-0603  [R0603]
R43  10K  RESISTOR-0603  [R0603]
R44  10K  RESISTOR-0603  [R0603]
R45  10K  RESISTOR-0603  [R0603]
SENS1  HIH-5031  [HIH-5031]
SENS2  MCP9701A  MCP9701  [SOT23]

### Nets
+3V3: R24.1 R27.1 R30.1 R33.1 ; also sheet 2,4,7
+5V: C24.1 C25.1 R25.1 R28.1 R31.1 R34.1 SENS1.3(V+) SENS2.1(VDD) ; also sheet 2,3,4,5,7,8
ADC7: C27.1 R45.2 ; also sheet 5
ADC8: C26.1 R44.2 ; also sheet 5
D12: R39.1 ; also sheet 5
D44: R36.1 ; also sheet 5
D45: R37.1 ; also sheet 5
D46: R38.1 ; also sheet 5
GND: C24.2 C25.2 C26.2 C27.2 Q4.2(S) Q5.2(S) Q6.2(S) Q7.2(S) R40.1 R41.1 R42.1 R43.1 SENS1.1(GND) SENS1.PAD SENS2.3(GND) ; also sheet 2,3,4,5,7,8
N$12: R45.1 SENS1.2(OUT)
N$13: R44.1 SENS2.2(VOUT)
N$14: Q4.1(G) R36.2 R40.2
N$17: Q5.1(G) R37.2 R41.2
N$18: Q6.1(G) R38.2 R42.2
N$19: Q7.1(G) R39.2 R43.2
PWM_1+: D7.C R24.2 R25.2 R26.2 ; also sheet 2
PWM_1-: D7.A Q4.3(D) ; also sheet 2
PWM_2+: D8.C R27.2 R28.2 R29.2 ; also sheet 2
PWM_2-: D8.A Q5.3(D) ; also sheet 2
PWM_3+: D9.C R30.2 R31.2 R32.2 ; also sheet 2
PWM_3-: D9.A Q6.3(D) ; also sheet 2
PWM_4+: D10.C R33.2 R34.2 R35.2 ; also sheet 2
PWM_4-: D10.A Q7.3(D) ; also sheet 2
V_BAT: R26.1 R29.1 R32.1 R35.1 ; also sheet 3,4

### Notes on the sheet
- PWM Outputs
- Humidity Sensor
- Populate one jumper only for
  each PWM channel.
  
  Select from maximum output
  of 3.3V, 5V, or battery voltage
  
  Default configuration is Battery Voltage
  on Channel 1 (LED Modules), and 5V
  on Channel 2 (Scaling Lasers)
- 30V
  3.4A
  63 mohm
- Temperature Sensor
- 30V
  3.4A
  63 mohm
- Temperature Sensor
  400 mV output at 0 deg C
  19.5 mV / deg C slope
- 30V
  3.4A
  63 mohm
- 30V
  3.4A
  63 mohm
- PWM and Environment Sensors
- --

## Sheet 7 of 8
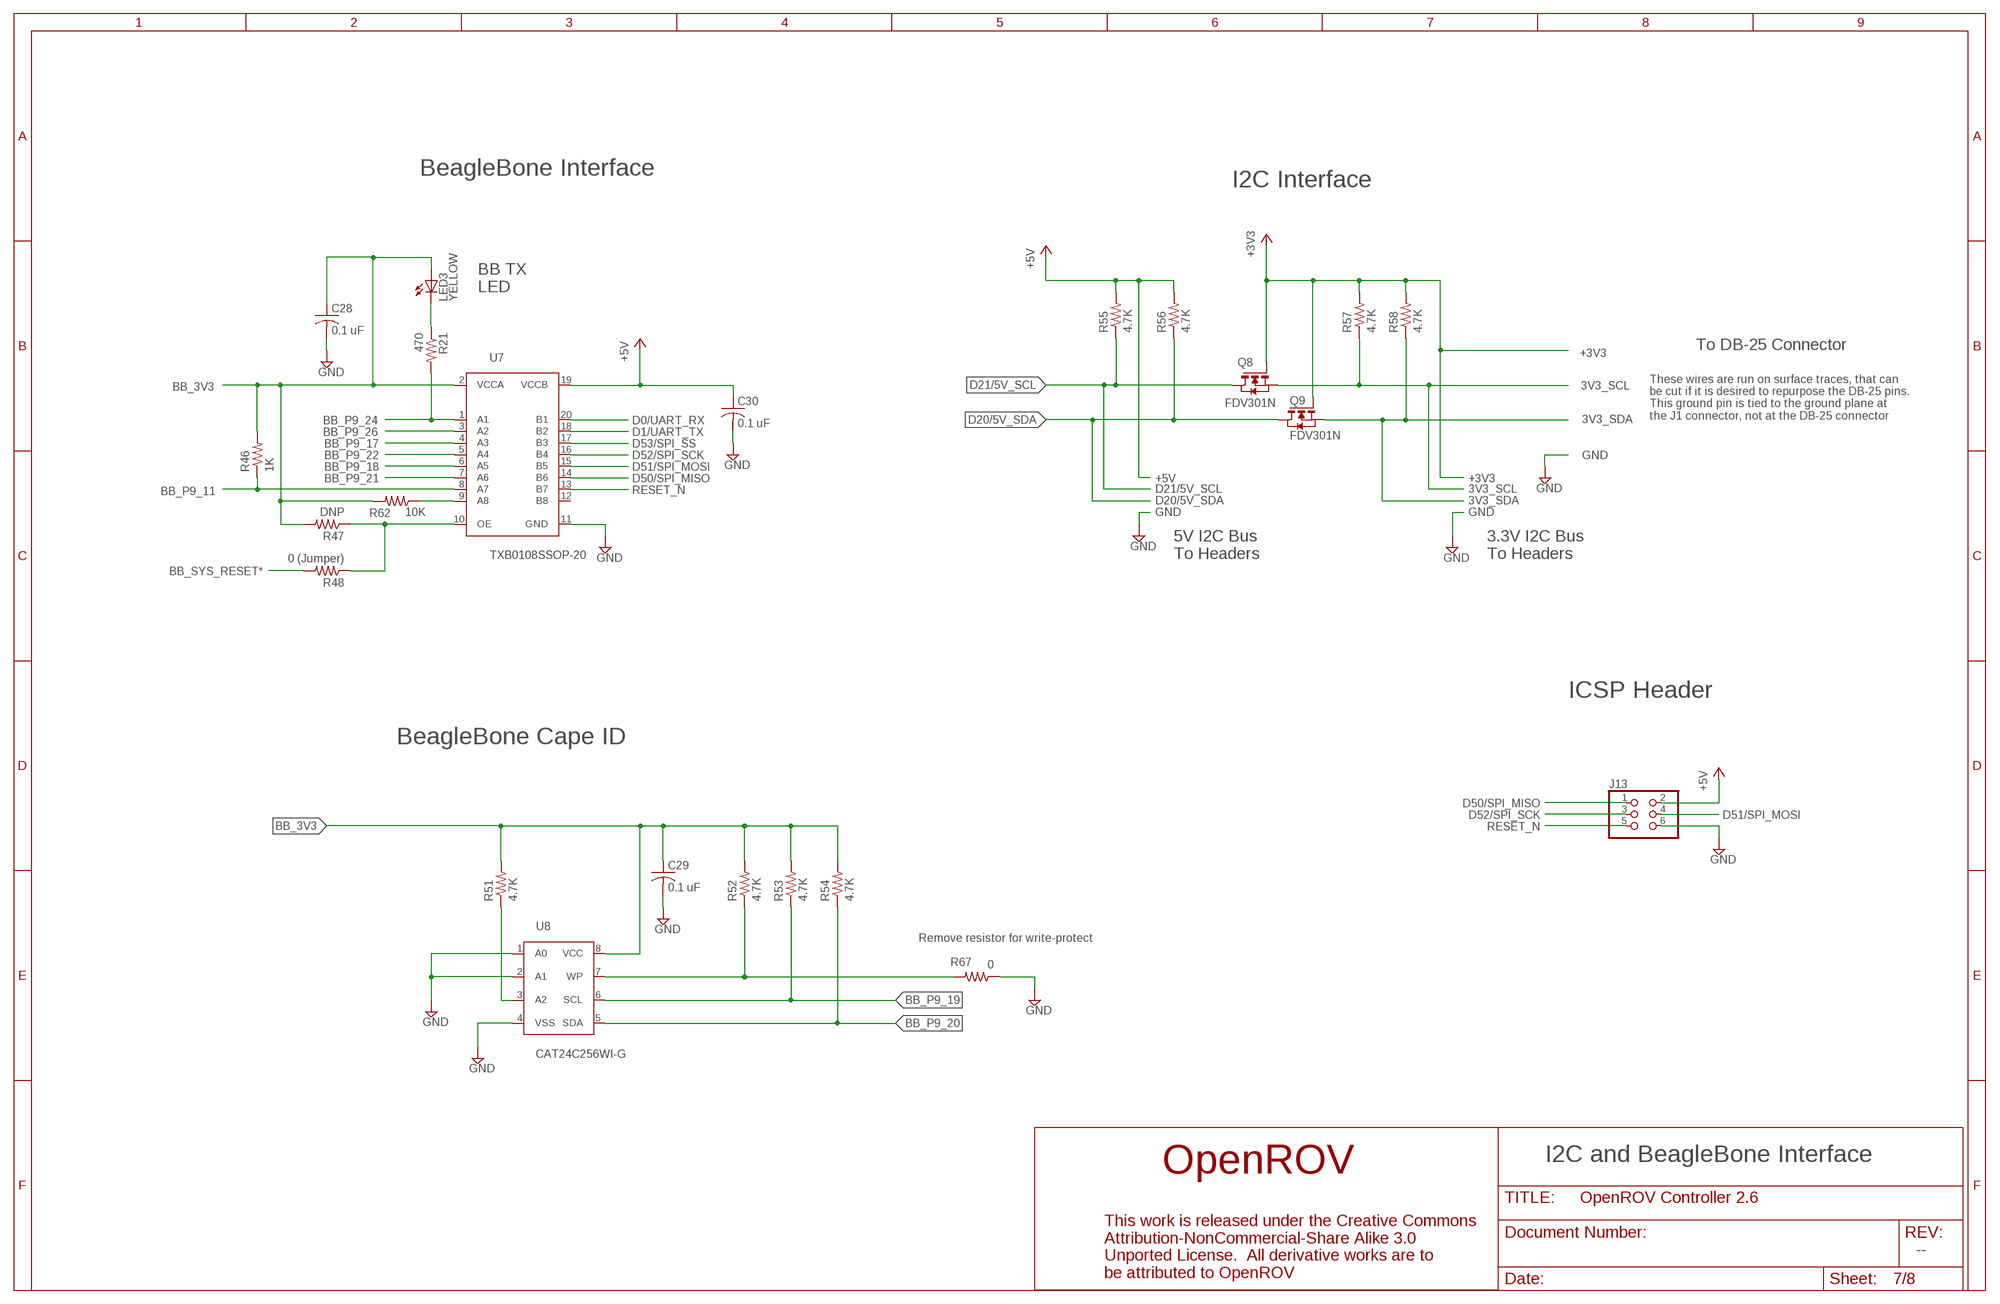
[diagram p6: schematic, sheet 7]

### Parts
C28  0.1 uF  CAP0603  [R0603]
C29  0.1 uF  CAP0603  [R0603]
C30  0.1 uF  CAP0603  [R0603]
J13  HDR_PINS_2X3  [HDR_PINS_2X3]
LED3  YELLOW  LED-0603  [LED_CHIPLED_0603]
Q8  FDV301N  NMOS-FETSOT23  [SOT23]
Q9  FDV301N  NMOS-FETSOT23  [SOT23]
R21  470  RESISTOR-0603  [R0603]
R46  1K  RESISTOR-0603  [R0603]
R47  DNP  RESISTOR-0603  [R0603]
R48  0 (Jumper)  RESISTOR-0603  [R0603]
R51  4.7K  RESISTOR-0603  [R0603]
R52  4.7K  RESISTOR-0603  [R0603]
R53  4.7K  RESISTOR-0603  [R0603]
R54  4.7K  RESISTOR-0603  [R0603]
R55  4.7K  RESISTOR-0603  [R0603]
R56  4.7K  RESISTOR-0603  [R0603]
R57  4.7K  RESISTOR-0603  [R0603]
R58  4.7K  RESISTOR-0603  [R0603]
R62  10K  RESISTOR-0603  [R0603]
R67  0  RESISTOR-0603  [R0603]
U7  TXB0108SSOP-20  [SSOP-20]
U8  CAT24C256WI-G  [SO8]

### Nets
3V3_SCL: Q8.2(S) R57.1 ; also sheet 2
3V3_SDA: Q9.2(S) R58.1 ; also sheet 2
+3V3: Q8.1(G) Q9.1(G) R57.2 R58.2 ; also sheet 2,4,6
+5V: C30.1 J13.2 R55.2 R56.2 U7.19(VCCB) ; also sheet 2,3,4,5,6,8
BB_3V3: C28.1 C29.1 LED3.A R46.2 R47.2 R51.2 R52.2 R53.2 R54.2 R62.2 U7.2(VCCA) U8.8(VCC) ; also sheet 2
BB_P9_11: R46.1 U7.8(A7) ; also sheet 2
BB_P9_17: U7.4(A3) ; also sheet 2
BB_P9_18: U7.6(A5) ; also sheet 2
BB_P9_19: R53.1 U8.6(SCL) ; also sheet 2
BB_P9_20: R54.1 U8.5(SDA) ; also sheet 2
BB_P9_21: U7.7(A6) ; also sheet 2
BB_P9_22: U7.5(A4) ; also sheet 2
BB_P9_24: R21.2 U7.1(A1) ; also sheet 2
BB_P9_26: U7.3(A2) ; also sheet 2
BB_SYS_RESET*: R48.2 ; also sheet 2
D0/UART_RX: U7.20(B1) ; also sheet 5
D1/UART_TX: U7.18(B2) ; also sheet 5
D20/5V_SDA: Q9.3(D) R56.1 ; also sheet 2,5
D21/5V_SCL: Q8.3(D) R55.1 ; also sheet 2,5
D50/SPI_MISO: J13.1 U7.14(B6) ; also sheet 5
D51/SPI_MOSI: J13.4 U7.15(B5) ; also sheet 5
D52/SPI_SCK: J13.3 U7.16(B4) ; also sheet 5
D53/SPI_SS: U7.17(B3) ; also sheet 5
GND: C28.2 C29.2 C30.2 J13.6 R67.1 U7.11(GND) U8.1(A0) U8.2(A1) U8.4(VSS) ; also sheet 2,3,4,5,6,8
N$34: R47.1 R48.1 U7.10(OE)
N$39: R52.1 R67.2 U8.7(WP)
N$40: R51.1 U8.3(A2)
N$43: LED3.C R21.1
N$44: R62.1 U7.9(A8)
RESET_N: J13.5 U7.13(B7) ; also sheet 5
Unconnected: U7.12(B8)

### Notes on the sheet
- BeagleBone Interface
- I2C Interface
- BB TX
  LED
- To DB-25 Connector
- These wires are run on surface traces, that can
  be cut if it is desired to repurpose the DB-25 pins.
  This ground pin is tied to the ground plane at
  the J1 connector, not at the DB-25 connector
- 5V I2C Bus
  To Headers
- 3.3V I2C Bus
  To Headers
- ICSP Header
- BeagleBone Cape ID
- Remove resistor for write-protect
- I2C and BeagleBone Interface
- --

## Sheet 8 of 8
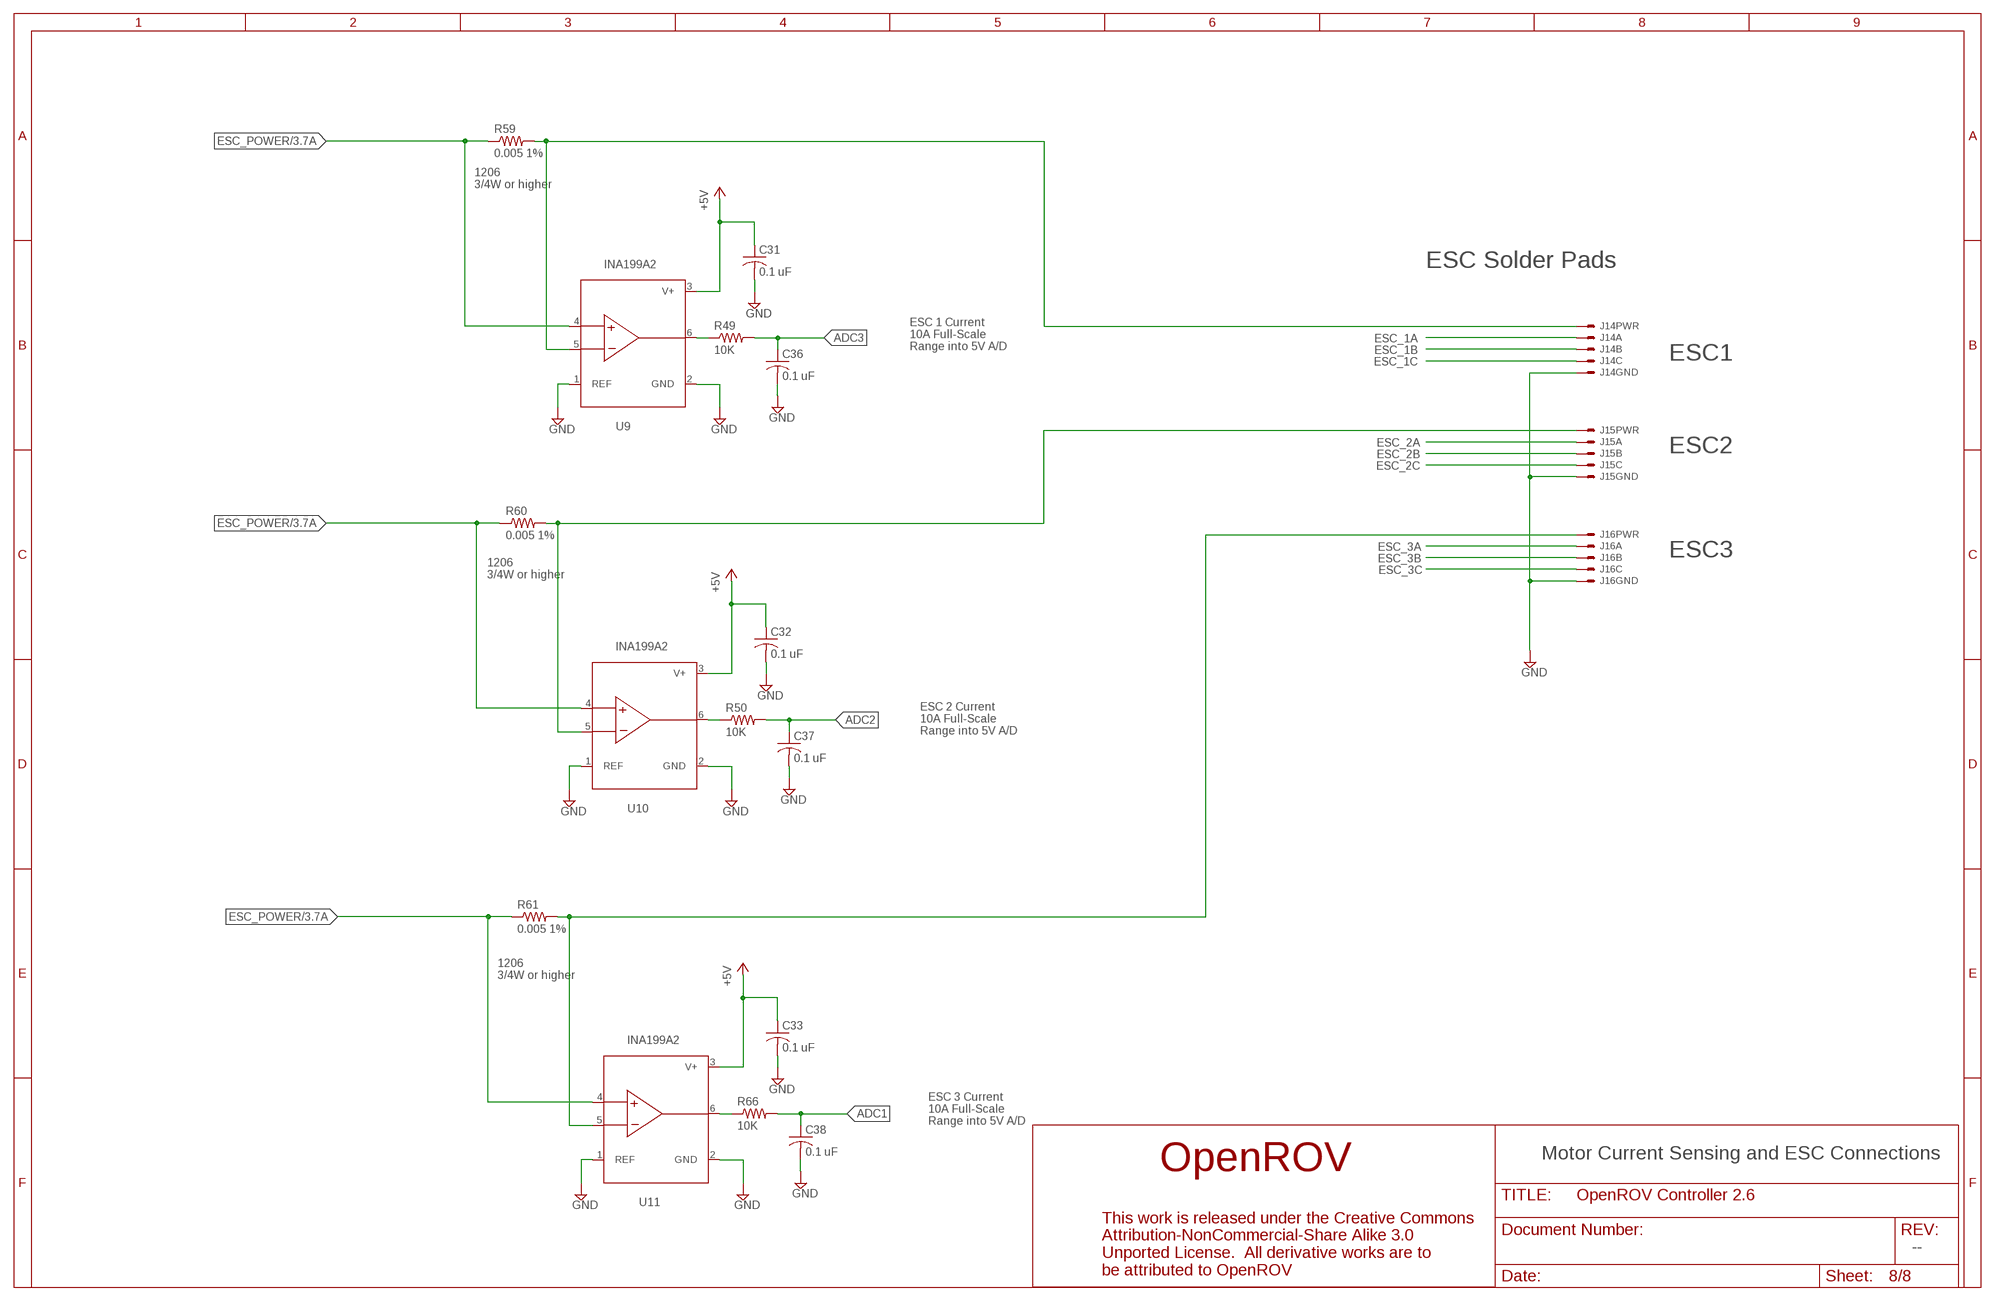
[diagram p7: schematic, sheet 8]

### Parts
C31  0.1 uF  CAP0603  [R0603]
C32  0.1 uF  CAP0603  [R0603]
C33  0.1 uF  CAP0603  [R0603]
C36  0.1 uF  CAP0603  [R0603]
C37  0.1 uF  CAP0603  [R0603]
C38  0.1 uF  CAP0603  [R0603]
J14  ESC_PADS-0.156_ALT  [ESC-PADS-.156-ALT_SILK]
J15  ESC_PADS-0.156_ALT  [ESC-PADS-.156-ALT_SILK]
J16  ESC_PADS-0.156_ALT  [ESC-PADS-.156-ALT_SILK]
R49  10K  RESISTOR-0603  [R0603]
R50  10K  RESISTOR-0603  [R0603]
R59  0.005 1%  RESISTOR-1206  [R1206]
R60  0.005 1%  RESISTOR-1206  [R1206]
R61  0.005 1%  RESISTOR-1206  [R1206]
R66  10K  RESISTOR-0603  [R0603]
U9  INA199A2  INA199  [SC70-6L]
U10  INA199A2  INA199  [SC70-6L]
U11  INA199A2  INA199  [SC70-6L]

### Nets
+5V: C31.1 C32.1 C33.1 U9.3(V+) U10.3(V+) U11.3(V+) ; also sheet 2,3,4,5,6,7
ADC1: C38.1 R66.2 ; also sheet 5
ADC2: C37.1 R50.2 ; also sheet 5
ADC3: C36.1 R49.2 ; also sheet 5
ESC1_PWR: J14.1 R59.2 U9.5(IN-)
ESC_1A: J14.2 ; also sheet 2
ESC_1B: J14.3 ; also sheet 2
ESC_1C: J14.4 ; also sheet 2
ESC_2A: J15.2 ; also sheet 2
ESC_2B: J15.3 ; also sheet 2
ESC_2C: J15.4 ; also sheet 2
ESC_3A: J16.2 ; also sheet 2
ESC_3B: J16.3 ; also sheet 2
ESC_3C: J16.4 ; also sheet 2
ESC_POWER: R59.1 R60.1 R61.1 U9.4(IN+) U10.4(IN+) U11.4(IN+) ; also sheet 3
ESC_PWR2: J15.1 R60.2 U10.5(IN-)
ESC_PWR3: J16.1 R61.2 U11.5(IN-)
GND: C31.2 C32.2 C33.2 C36.2 C37.2 C38.2 J14.5 J15.5 J16.5 U9.1(REF) U9.2(GND) U10.1(REF) U10.2(GND) U11.1(REF) U11.2(GND) ; also sheet 2,3,4,5,6,7
N$37: R49.1 U9.6(VOUT)
N$38: R50.1 U10.6(VOUT)
N$47: R66.1 U11.6(VOUT)

### Notes on the sheet
- 1206
  3/4W or higher
- ESC Solder Pads
- ESC 1 Current
  10A Full-Scale
  Range into 5V A/D
- ESC1
- ESC2
- ESC3
- 1206
  3/4W or higher
- ESC 2 Current
  10A Full-Scale
  Range into 5V A/D
- 1206
  3/4W or higher
- ESC 3 Current
  10A Full-Scale
  Range into 5V A/D
- Motor Current Sensing and ESC Connections
- --

## Library data of the parts
C1-C33 C35-C38 = Walts_Generic_Parts:CAP: Generic Non-Polarized Capacitor
C34 = Walts_Generic_Parts:CAP-POLARIZED
D1 D2 D6 = Walts_Generic_Parts:SCHOTTKY: Silicon Schottky Diodes
D3-D5 = Walts_Generic_Parts:ZENER-TVS: Generic Zener Diode or TVS
D7-D10 = Walts_Generic_Parts:DIODE: Generic Diode Devices
F1 = Walts_Generic_Parts:POLYFUSE: Polyfuse / PPTC
FB1 = Walts_Generic_Parts:FERRITE: Generic Surface Mount Ferrite Chip
FID1-FID5 = Walts Test Points and Pads:FIDUCIAL_1: Alignment Fiducial
J1-J4 = OpenROV Controller 2.5:HDR_SOCKET_2X8: 2x8 THROUGH-HOLE .025" SQ POST SOCKET Based upon Samtec SSW-108-02-S-D; MPN: SSW-108-02-S-D; OC_FARNELL: unknown; OC_NEWARK: 85K7646
J5 = OpenROV General Library:M25VP: 25-pin Vertical Male D-SUB Adapted from con-subd library; OC_FARNELL: unknown; OC_NEWARK: unknown
J6 = OpenROV General Library:BEAGLEBONE_PIN_HEADER: 46-pin Header for BeagleBone Source: Based upon Samtec TSW series; OC_FARNELL: unknown; OC_NEWARK: unknown
J7 J11 J12 J17 = Walts Generic Connectors:HDR_1X2X0.100: .100" (2.54mm) Center Header - 2 Pin Derived from Molex 22-23-2021
J9 J10 = Walts Generic Connectors:HDR_1X3X0.100: .100" (2.54mm) Center Header - 3 Pin
J13 = OpenROV Controller 2.5:HDR_PINS_2X3: 2x3 PIN HEADER Derived from Arduino Mega library
J14-J16 = OpenROV General Library:ESC_PADS: Solder Pads for ESC Derived from Molex KK 0.156" Header, with holes opened up
J18 J19 = OpenROV Controller 2.5:HDR_SOCKET_2X3: 2X3 THROUGH-HOLE .025" SQ POST SOCKET Based upon Samtec SSW-103-02-S-D; MPN: SSW-103-02-S-D; OC_FARNELL: unknown; OC_NEWARK: 11P9365
J20 J21 = OpenROV Controller 2.5:HDR_PINS_3X3: 3x3 0.100 Header Pins Based upon Samtec TSW series
L1 = OpenROV Controller 2.5:INDUCTOR: Coilcraft MSS1048-series inductors
LED1-LED8 = Walts_Generic_Parts:LED: Generic LED
OC1 = OpenROV Controller 2.5:LTV-8141S: Lite-On Bidirectional-Input Optocoupler with Darlington Output
Q1 Q3 = Walts_Generic_Parts:PMOS-FET: Generic PMOS FET
Q2 Q4-Q9 = Walts_Generic_Parts:NMOS-FET: Generic NMOS FET
R1-R67 = Walts_Generic_Parts:RESISTOR: Generic Resistor
SENS1 = OpenROV Controller 2.5:HIH-5031: Honeywell Humidity Sensor
SENS2 = OpenROV Controller 2.5:MCP9701: Microchip Temperature Sensor. "A" version has better accuracy
TP2 TP3 TP20-TP25 = Walts Test Points and Pads:TEST_PAD: THROUGH-HOLE PADS Derived from Eagle wirepad.lbr library
U1-U3 U9-U11 = OpenROV Controller 2.5:INA199
U4 = OpenROV Controller 2.5:LM25011: TI LM25011 Switching Converter
U5 = OpenROV Controller 2.5:AP1117: Diodes, Inc. Voltage Regulator
U6 = OpenROV Controller 2.5:SMARTPRJ_ATMEGA2560: ATMEGA MICROCONTROLLER from Arduino Refernce Design 64/128/256 Kbytes FLASH 4 Kbytes EEPROM 8 Kbytes SRAM 86 General Purpose I/O pins 12-channels16-bit PWM 4 x Serial USARTs 16-channels 10-bit A/D
U7 = OpenROV Controller 2.5:TXB0108: TI Bidirectional Level Translator
U8 = OpenROV Controller 2.5:CAT24C256: I2C EEPROM for BeagleBone Capes
X1 = OpenROV Controller 2.5:CRYSTAL: Crystal